# EasyEDA Pro project ProPrj_信号失真度测量_2025-12-22.epro

# Schematic Schematic3
Board Name: Board3; Create Date: 2025-10-08; Page Name: P1; Project Name: 信号失真度测量; Schematic Name: Schematic3; Update Date: 2025-10-08; Company: 嘉立创EDA; Page Size: A4; Version: V1.0
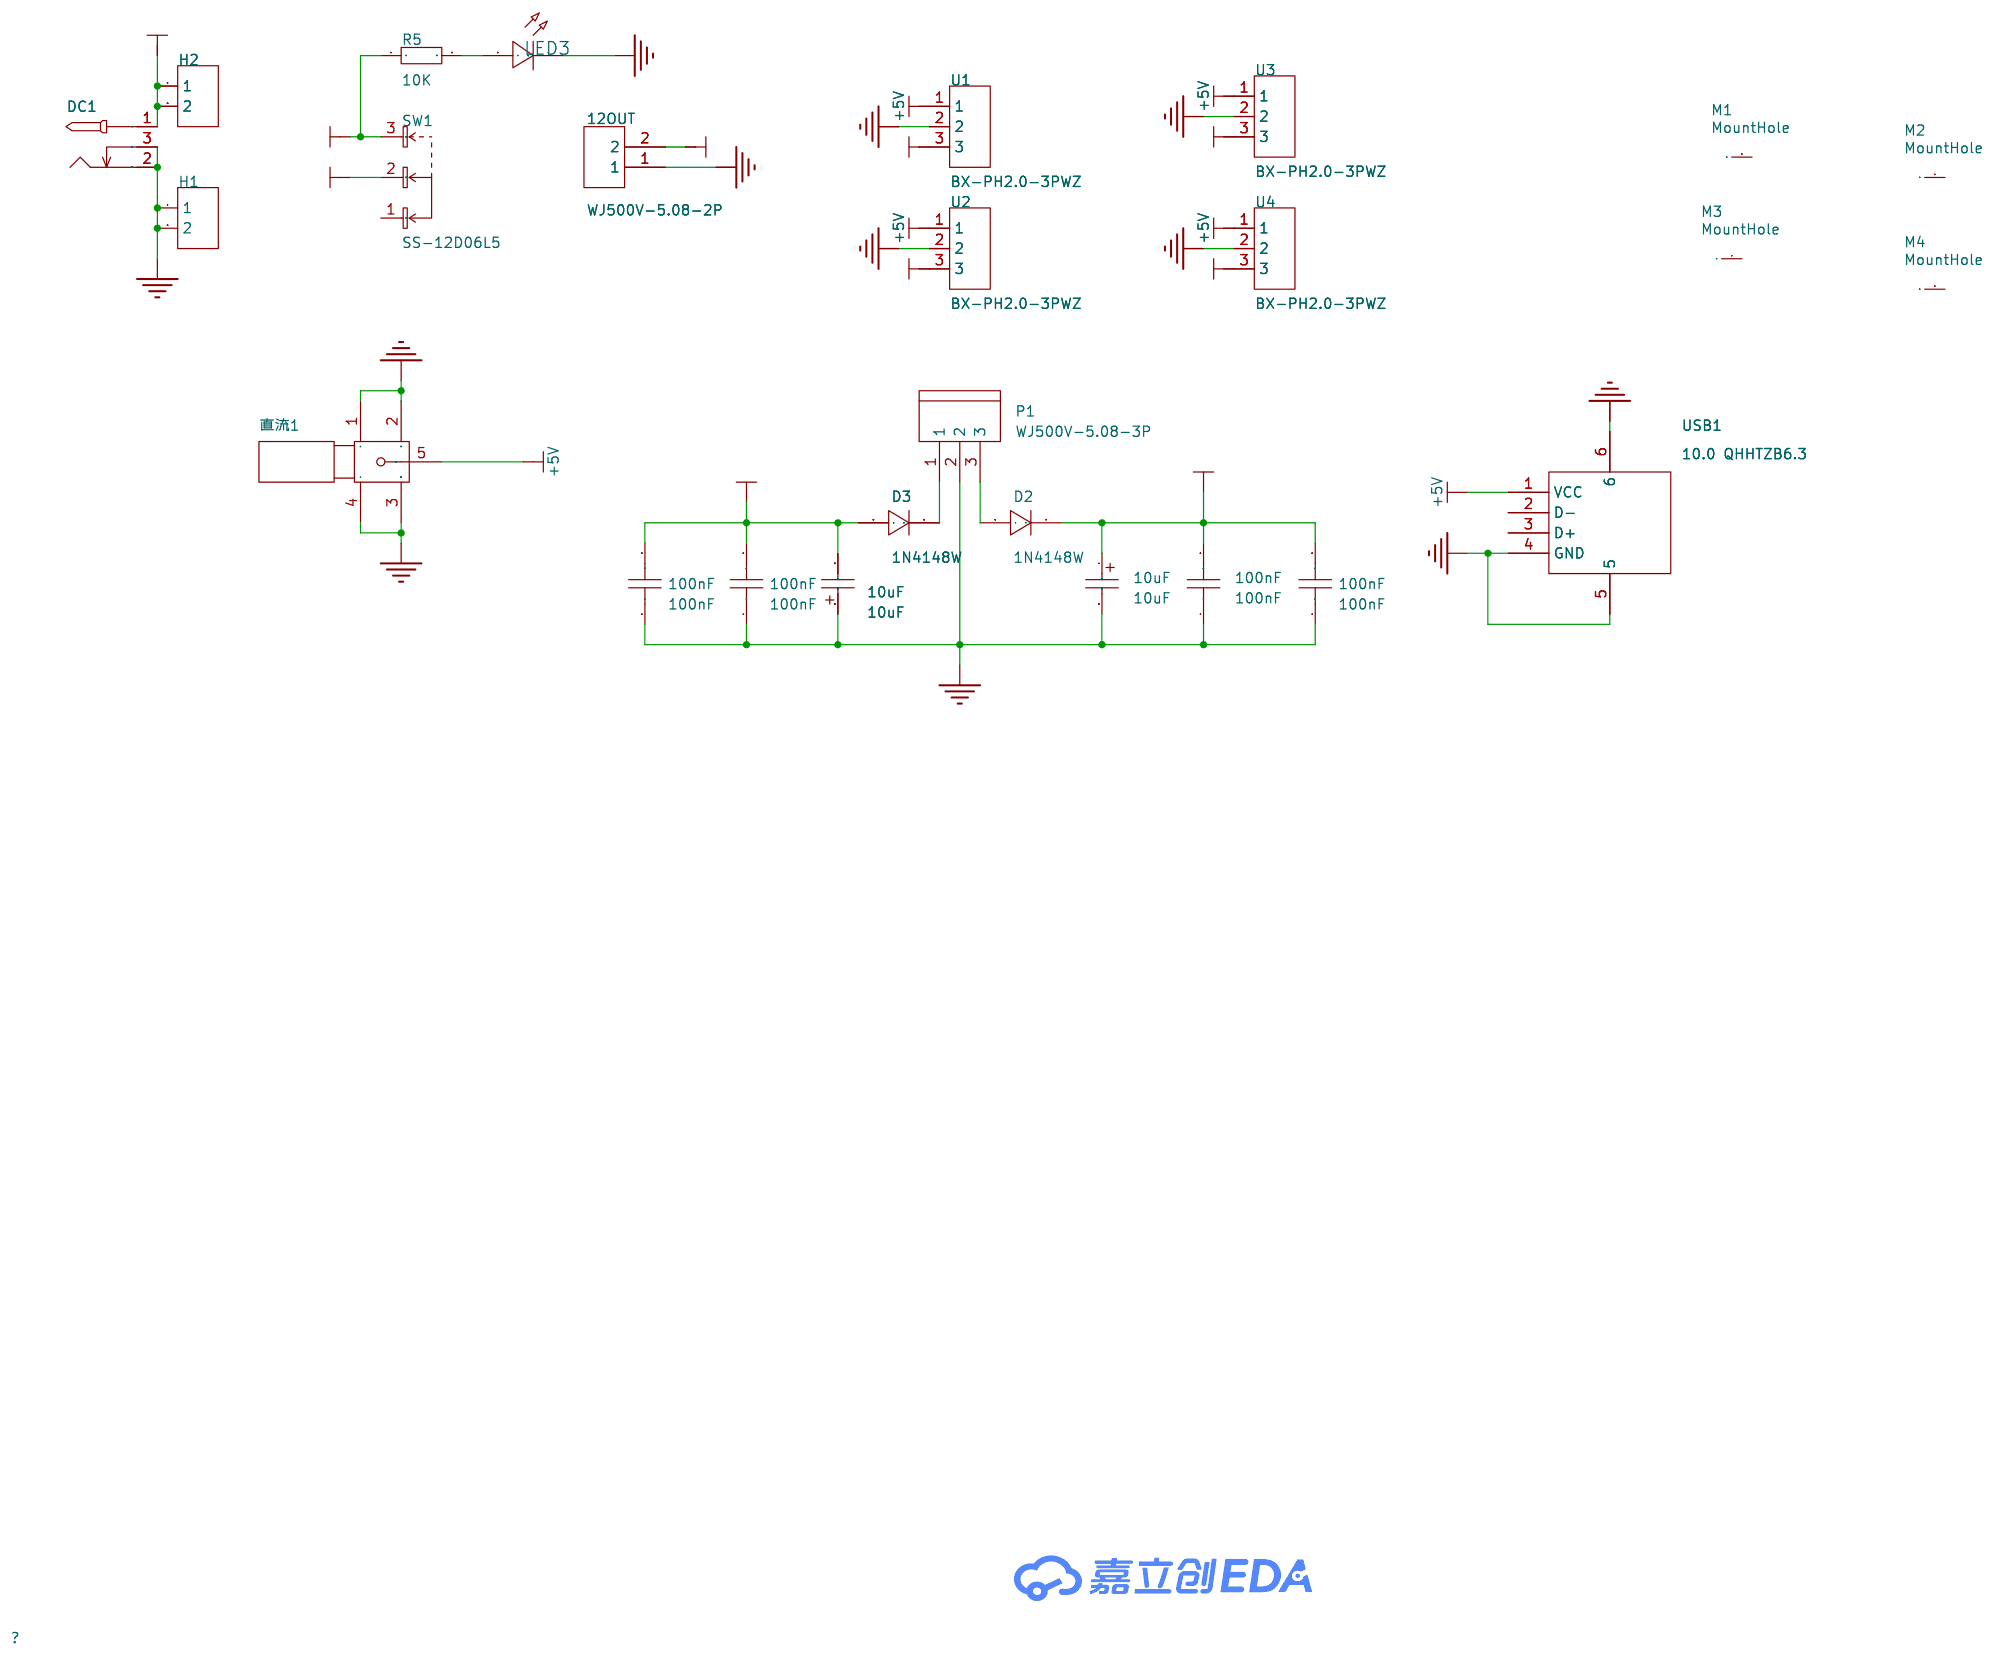
[diagram p0: schematic sheet]

## Parts
10uF  10uF  [C_Ele_SMD_5x5.4mm]
10uF#2  10uF  [C_Ele_SMD_5x5.4mm]
12OUT  WJ500V-5.08-2P  [CONN-TH_2P-P5.00_WJ500V-5.08-2P]
100nF  100nF  [C0805]
100nF#2  100nF  [C0805]
100nF#3  100nF  [C0805]
100nF#4  100nF  [C0805]
D2  1N4148W  [SOD-123F_L2.7-W1.6-LS3.8-RD]
D3  1N4148W  [SOD-123F_L2.7-W1.6-LS3.8-RD]
DC1  -  [DC-005_2.5]
H1  -  [HDR-TH_2P-P2.54-V-F]
H2  -  [HDR-TH_2P-P2.54-V-F]
LED3  -  [LED_0805]
M1  MountHole  [M3-MOUNTHOLE-PLATED]  (no BOM)
M2  MountHole  [M3-MOUNTHOLE-PLATED]  (no BOM)
M3  MountHole  [M3-MOUNTHOLE-PLATED]  (no BOM)
M4  MountHole  [M3-MOUNTHOLE-PLATED]  (no BOM)
P1  WJ500V-5.08-3P  [CONN-TH_3P-P5.00_WJ500V-5.08-3P]
R5  10K  [R0805]
SW1  SS-12D06L5  [SW-TH_3P-P4.70_L11.1-W12.7]
U1  BX-PH2.0-3PWZ  [CONN-TH_3P-P2.00_BX-PH2.0-3PWZ]
U2  BX-PH2.0-3PWZ  [CONN-TH_3P-P2.00_BX-PH2.0-3PWZ]
U3  BX-PH2.0-3PWZ  [CONN-TH_3P-P2.00_BX-PH2.0-3PWZ]
U4  BX-PH2.0-3PWZ  [CONN-TH_3P-P2.00_BX-PH2.0-3PWZ]
USB1  10.0 QHHTZB6.3  [USB-A-TH_10.0QHHTZB6.3]
直流1  -  [SMA-TH_BWSMA-KE-Z001]

## Library data of the parts
10uF 10uF#2 = C_Ele_SMD_5x5.4mm: Supplier Footprint: SMD,5x5.4mm
12OUT = WJ500V-5.08-2P: 结构:1x2P;间距:5.08mm;颜色:绿色;安装方式:直插;额定电流:18A;额定电压:250V;排数:1;线规 - AWG:14~30;线规 - 平方毫米:2.5;每排PIN数:2;触头材质:-;触头镀层:-;工作温度范围:-40℃~+105℃;焊接温度(最大值):-;; LCSC Part Name: 1x2P 5.08mm 直插 排数:1 每排P数:2; Supplier Part: C8465; Manufacturer: KANGNEX(康奈克斯电气); Supplier Footprint: 插件,P=5.08mm; JLCPCB Part Class: 扩展库; Datasheet: https://atta.szlcsc.com/upload/public/pdf/source/20191225/C8465_02D34CE5B5B4A53DF5891601D97FA9F4.pdf; Supplier: LCSC; Structure: 1x2P; Pitch: 5.08mm; Color: 绿色; Mounting Style: 直插; Current Rating (Max): 18A; Voltage Rating (Max): 250V; Number of Pins: 2P; Number of Rows: 1; Wire Gauge - AWG: 14~30; Wire Gauge - mm2: 2.5; Number of PINs Per Row: 2; Operating Temperature Range: -40℃~+105℃; Screw Specification: M2.5
100nF 100nF#2-100nF#4 = CAP_0805: Supplier Footprint: 0805
D2 D3 = 1N4148W_C81598: 二极管配置:独立式;正向压降(Vf):1V@50mA;直流反向耐压(Vr):75V;整流电流:150mA;反向恢复时间(Trr):4ns;; Supplier Part: C81598; Manufacturer: ST(先科); Supplier Footprint: SOD-123; JLCPCB Part Class: 基础库; Datasheet: https://item.szlcsc.com/datasheet/1N4148W/82750.html; Supplier: LCSC; Diode Configuration: 独立式; Voltage - Forward(Vf@If): 1V@50mA; Voltage - DC Reverse(Vr): 75V; Current - Rectified: 150mA; Pd - Power Dissipation: 400mW; Reverse Leakage Current (Ir): 1uA@75V; Reverse Recovery Time (trr): 4ns; Non-Repetitive Peak Forward Surge Current: 1A
DC1 = DC-005_2.5: Supplier Footprint: 插件
H1 H2 = HDR-F_2.54_1x2P: Supplier Part: C49661; Supplier Footprint: 插件; Supplier: LCSC; Manufacturer: BOOMELE(博穆精密); Manufacturer Part: 2.54-1*2P母; JLCPCB Part Class: Extended Part
LED3 = LED_0805-R: Supplier Footprint: 0805
M1-M4 = MountHole
P1 = WJ500V-5.08-3P: 结构:1x3P;间距:5.08mm;颜色:绿色;安装方式:直插;额定电流:18A;额定电压:250V;排数:1;线规 - AWG:14~30;线规 - 平方毫米:2.5;每排PIN数:3;工作温度范围:-40℃~+105℃;; LCSC Part Name: 5.08mm 1x3P 排数:1 每排P数:3 直插; Supplier Part: C72334; Manufacturer: KANGNEX(康奈克斯电气); Supplier Footprint: 插件,P=5.08mm; JLCPCB Part Class: 扩展库; Datasheet: https://atta.szlcsc.com/upload/public/pdf/source/20191225/C72334_8A5EF831D67650233B6B1E3F2BC06274.pdf; Supplier: LCSC; Structure: 1x3P; Pitch: 5.08mm; Color: 绿色; Mounting Style: 直插; Current Rating (Max): 18A; Voltage Rating (Max): 250V; Number of Pins: 3P; Number of Rows: 1; Wire Gauge - AWG: 14~30; Wire Gauge - mm2: 2.5; Number of PINs Per Row: 3; Operating Temperature Range: -40℃~+105℃
R5 = Res_0805: Supplier Footprint: 0805
SW1 = SS-12D06L5: 电路结构:单刀双掷;安装方式:侧插;开关颜色:黑色;额定电流(DC):3A;额定电压(DC):250V;额定电流(AC):3A;额定电压(AC):250V;机械寿命:1万次;; LCSC Part Name: 柄长5mm 卧插双档 滑动开关; Supplier Part: C319015; Manufacturer: XKB Connectivity(中国星坤); Supplier Footprint: 插件; JLCPCB Part Class: 扩展库; Datasheet: https://atta.szlcsc.com/upload/public/pdf/source/20211009/0D67854FD60FB1F6FE75130AD47C052C.pdf; Supplier: LCSC; Circuit: 单刀双掷; Actuator Style: 矩形柱状; Pin Style: PC引脚; Switch Length: 12.95mm; Switch Width: 6.6mm; Switch Height: 6.3mm; Mounting Style: 侧插; Actuator Color: 黑色; Current Rating (DC): 3A; Voltage Rating (DC): 250V; Current Rating (AC): 3A; Voltage Rating (AC): 250V; Mechanical Life: 1万次; Operating Temperature: -40℃~+85℃
U1-U4 = BX-PH2.0-3PWZ_C9900091690: Supplier Part: C9900091690; Supplier Footprint: PH2.0D-W-3P; JLCPCB Part Class: 扩展库; Supplier: LCSC
USB1 = 10.0 QHHTZB6.3: 连接器类型:Type-A;协议标准:USB 2.0;公母:母;安装方式:卧贴;触点数量:4P;端口数量:1;额定电流 - 电源:1.5A;工作温度:-25℃~+85℃;; LCSC Part Name: Type-A 母 卧贴; Supplier Part: C668591; Manufacturer: SHOU HAN(首韩); Supplier Footprint: SMD; JLCPCB Part Class: 扩展库; Datasheet: https://item.szlcsc.com/datasheet/10.0%2520QHHTZB6.3/698534.html; Supplier: LCSC; Connector Type: Type-A; Protocol Standard: USB 2.0; Gender: 母; Mounting Type: 卧贴; Number of Contacts: 4P; Number of Ports: 1; Current Rating-Power: 1.5A; Voltage Rating: 30V; Connect-Disconnect Life: 5千次; Length: 10mm; Detection color: 黑色; Operating Temperature: -25℃~+85℃
直流1 = BWSMA-KE-Z001_C496549: 连接器类型:板端;接口类型:内孔;端口数量:1;接口直径:-;接口长度/高度:-;频率:-;射频系列:SMA;阻抗:50Ω;样式:正脚;工作温度:-65℃~+165℃;; LCSC Part Name: 内孔 SMA 正脚; Supplier Part: C496549; Manufacturer: BAT WIRELESS(蝙蝠无线); Manufacturer Part: BWSMA-KE-Z001; Supplier Footprint: 插件; JLCPCB Part Class: 扩展库; Datasheet: https://item.szlcsc.com/datasheet/BWSMA-KE-Z001/508498.html; Supplier: LCSC; Connector Type: 板端; Interface: 内孔; Number of Ports: 1; RF Series: SMA; Impedance: 50Ω; Style: 正脚; Operating Temperature Range: -65℃~+165℃

## Nets
+5V: 10uF#2.1 100nF#2.2 100nF#4.2 D2.1(K) U1.1 U2.1 U3.1 U4.1 USB1.1(VCC) 直流1.5
+12V: DC1.1(4) H2.1 H2.2 SW1.2
-5V: 10uF.2 100nF.2 100nF#3.2 D3.2(A) U1.3 U2.3 U3.3 U4.3
GND: 10uF.1 10uF#2.2 12OUT.1 100nF.1 100nF#2.1 100nF#3.1 100nF#4.1 DC1.2 DC1.3 H1.1 H1.2 LED3.1(C) P1.2 U1.2 U2.2 U3.2 U4.2 USB1.4(GND) USB1.5 USB1.6 直流1.1 直流1.2 直流1.3 直流1.4
VIN: 12OUT.2 R5.1 SW1.3
$1N706: LED3.2(A) R5.2
$1N2849: D3.1(K) P1.1
$1N2856: D2.2(A) P1.3

Not connected (* = marked no-connect by the designer): M1 1; M2 1; M3 1; M4 1; SW1 1; USB1 2(D-) 3(D+)

# Schematic Schematic1
Board Name: Board1; Create Date: 2025-10-08; Page Name: P1; Project Name: 信号失真度测量; Schematic Name: Schematic1; Update Date: 2025-12-13; Company: 嘉立创EDA; Page Size: A4; Version: V1.0
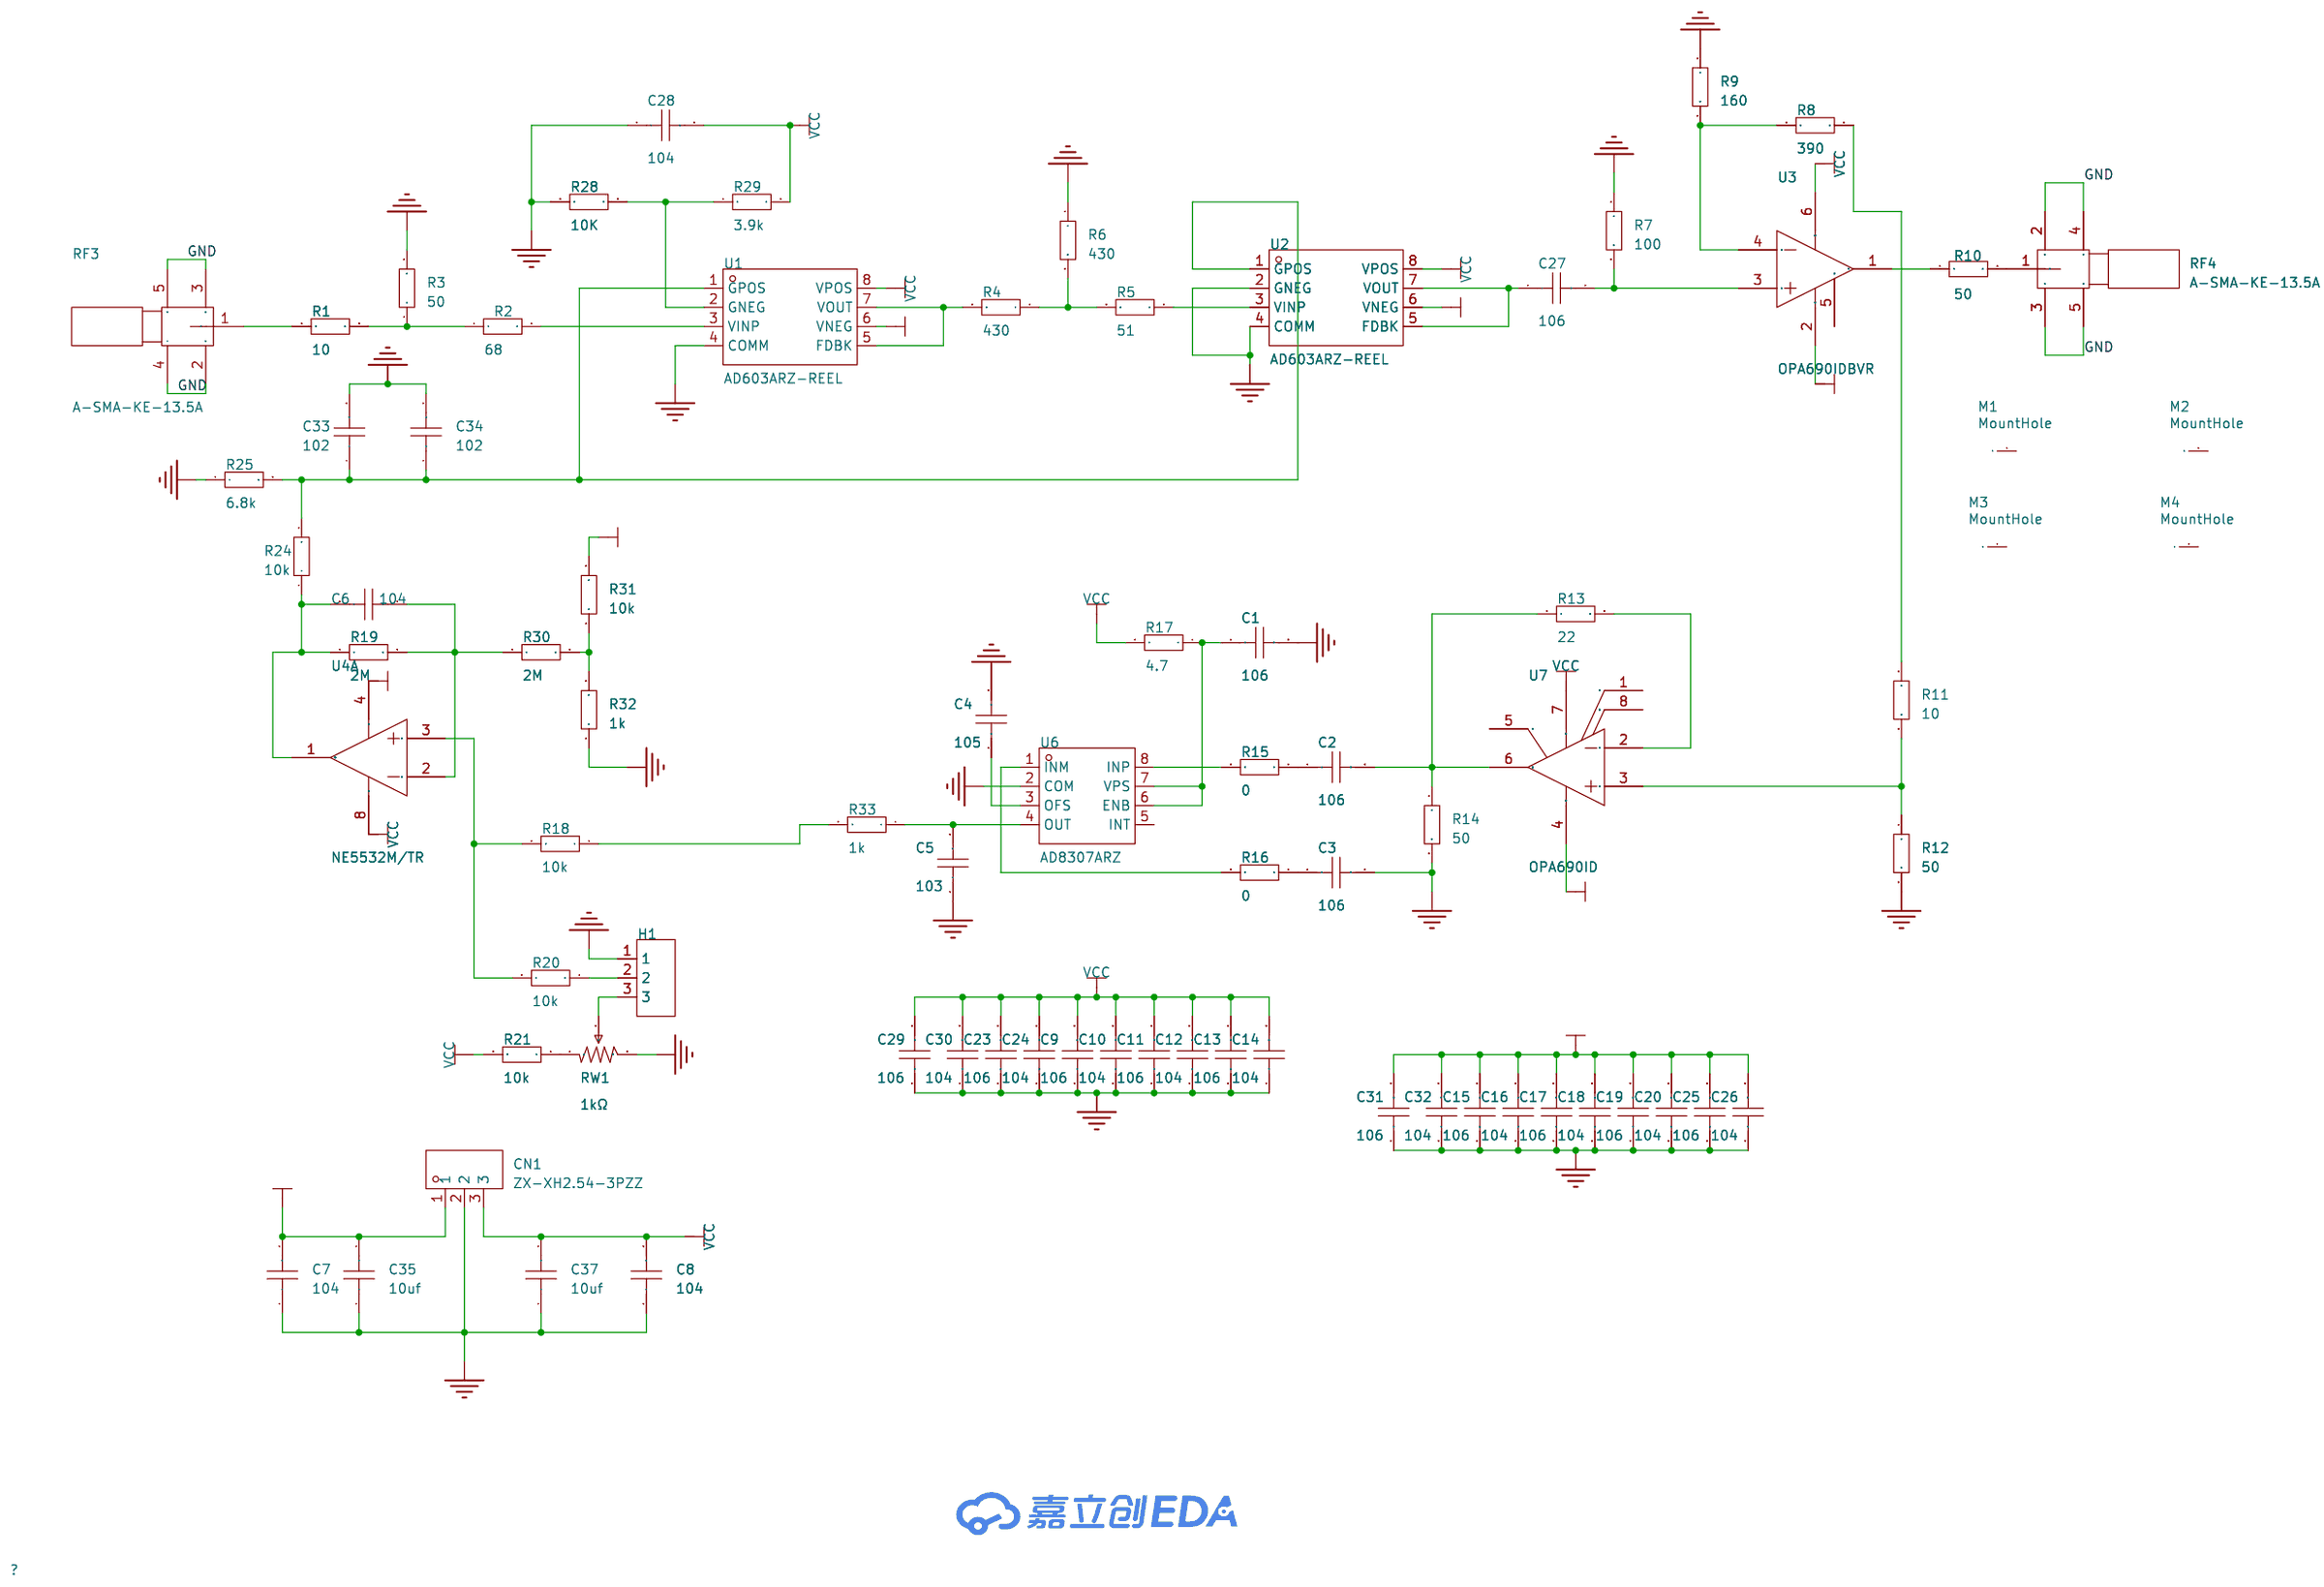
[diagram p1: schematic sheet]

## Parts
C1  106  [C0805]
C2  106  [C0805]
C3  106  [C0805]
C4  105  [C0805]
C5  103  [C0805]
C6  104  [C0805]
C7  104  [C0805]
C8  104  [C0805]
C9  106  [C0805]
C10  104  [C0805]
C11  106  [C0805]
C12  104  [C0805]
C13  106  [C0805]
C14  104  [C0805]
C15  106  [C0805]
C16  104  [C0805]
C17  106  [C0805]
C18  104  [C0805]
C19  106  [C0805]
C20  104  [C0805]
C23  106  [C0805]
C24  104  [C0805]
C25  106  [C0805]
C26  104  [C0805]
C27  106  [C0805]
C28  104  [C0805]
C29  106  [C0805]
C30  104  [C0805]
C31  106  [C0805]
C32  104  [C0805]
C33  102  [C0805]
C34  102  [C0805]
C35  10uf  [C0805]
C37  10uf  [C0805]
CN1  ZX-XH2.54-3PZZ  [CONN-TH_3P-P2.54_2501S-3P]
H1  -  [HDR-TH_3P-P2.54-V-F]
M1  MountHole  [M3-MOUNTHOLE-PLATED]  (no BOM)
M2  MountHole  [M3-MOUNTHOLE-PLATED]  (no BOM)
M3  MountHole  [M3-MOUNTHOLE-PLATED]  (no BOM)
M4  MountHole  [M3-MOUNTHOLE-PLATED]  (no BOM)
R1  10  [R0805]
R2  68  [R0805]
R3  50  [R0805]
R4  430  [R0805]
R5  51  [R0805]
R6  430  [R0805]
R7  100  [R0805]
R8  390  [R0805]
R9  160  [R0805]
R10  50  [R0805]
R11  10  [R0805]
R12  50  [R0805]
R13  22  [R0805]
R14  50  [R0805]
R15  0  [R0805]
R16  0  [R0805]
R17  4.7  [R0805]
R18  10k  [R0805]
R19  2M  [R0805]
R20  10k  [R0805]
R21  10k  [R0805]
R24  10k  [R0805]
R25  6.8k  [R0805]
R28  10K  [R0805]
R29  3.9k  [R0805]
R30  2M  [R0805]
R31  10k  [R0805]
R32  1k  [R0805]
R33  1k  [R0805]
RF3  A-SMA-KE-13.5A  [SMA-SMD_A-SMA-KE-13.5A]
RF4  A-SMA-KE-13.5A  [SMA-SMD_A-SMA-KE-13.5A]
RW1  1kΩ  [RES-ADJ-TH_3P-L9.5-W4.9-P2.50-L_3296W]
U1  AD603ARZ-REEL  [SOIC-8_L4.9-W3.9-P1.27-LS6.0-BL]
U2  AD603ARZ-REEL  [SOIC-8_L4.9-W3.9-P1.27-LS6.0-BL]
U3  OPA690IDBVR  [SOT-23-6_L2.9-W1.6-P0.95-LS2.8-BL]
U4  NE5532M/TR  [SOP-8_L4.9-W3.9-P1.27-LS6.0-BL]  (section 1)
U6  AD8307ARZ  [SOIC-8_L4.9-W3.9-P1.27-LS6.0-BL]
U7  OPA690ID  [SOIC-8_L4.9-W3.9-P1.27-LS6.0-BL]

## Library data of the parts
C1-C20 C23-C35 C37 = CAP_0805: Supplier Footprint: 0805
CN1 = ZX-XH2.54-3PZZ: 插针结构:1x3P;间距:2.5mm;安装方式:直插;参考系列:XH;总PIN数:3P;排数:1;每排PIN数:3;行距:-;额定电流:3A;触头材质:黄铜;触头镀层:锡;工作温度:-25℃~+85℃;; LCSC Part Name: 1x3P 间距:2.5mm 直插 系列:XH; Supplier Part: C7429633; Manufacturer: Megastar(兆星); Supplier Footprint: 插件,P=2.5mm; JLCPCB Part Class: 扩展库; Datasheet: https://item.szlcsc.com/datasheet/ZX-XH2.54-3PZZ/8427550.html; Supplier: LCSC; Pins Structure: 1x3P; Pitch: 2.5mm; Mounting Type: 直插; Reference Series: XH; Number of Pins: 3P; Number of Rows: 1; Number of PINs Per Row: 3; Current Rating: 3A; Contact Material: 黄铜; Contact Plating: 锡; Operating Temperature: -25℃~+85℃; Voltage Rating: 250V; Plastic Material: PA66; Flame Retardant Rating: UL94V-0; Color: 白色; Z-Height of the Board: 7mm; X-Length of Bottom Edge on Board (Spacing Line): 10mm; Y-Width of Bottom Edge on Board: 5.9mm
H1 = HDR-F_2.54_1x3P: Supplier Part: C541850; Supplier Footprint: 插件
M1-M4 = MountHole
R1-R21 R24 R25 R28-R33 = Res_0805: Supplier Footprint: 0805
RF3 RF4 = A-SMA-KE-13.5A: 样式：偏脚 接口长度：6.5mm 射频SMA-KE/KWE/KHD/IPEX/IPX接头 天线插座 内孔弯头偏脚立式      镀金 SMA—KE直头外螺纹内孔半螺牙；铜镀金 1：高等级黄铜材质镀真金，镀金2u/1u； 2：纯铜无杂质高品质可过环保认证； 3：经过高精密盐雾48H； 4：防止氧化，抗氧化性比较好，耐腐蚀，可减少损耗。; LCSC Part Name: 内孔 SMA SMA母头PCB天线座/安装直头/SMA端口 RF射频天线直头端子 13.5mm; Supplier Part: C22467594; Manufacturer: MyAntenna(摩天射频); Supplier Footprint: SMD; JLCPCB Part Class: 扩展库; Datasheet: https://item.szlcsc.com/datasheet/A-SMA-KE-13.5A/24170451.html; Supplier: LCSC
RW1 = 3296W-1-204LF_C49190460: 阻值:200kΩ;精度:±10%;功率:500mW;温度系数:±150ppm/℃;; LCSC Part Name: 3296W-1-204LF; Supplier Part: C49190460; Manufacturer: JIERR(捷而瑞); Manufacturer Part: 3296W-1-204LF; Supplier Footprint: 插件-3P,9.5x4.9mm; JLCPCB Part Class: 扩展库; Datasheet: https://item.szlcsc.com/datasheet/3296W-1-204LF/51587053.html; Supplier: LCSC; Tolerance: ±10%; Power(Watts): 500mW; Temperature Coefficient: ±150ppm/℃; Number of Turns: 28
U1 U2 = AD603ARZ-REEL: 低噪声、90MHz可变增益放大器; LCSC Part Name: 低噪声90MHz可变增益放大器; Supplier Part: C578331; Manufacturer: ADI(亚德诺); Supplier Footprint: SOIC-8; JLCPCB Part Class: 扩展库; Datasheet: https://atta.szlcsc.com/upload/public/pdf/source/20200225/C428870_2540098E542F69B8418644EFC7A80A81.pdf; Supplier: LCSC
U3 = OPA690IDBVR: 放大器数:单路;轨到轨:-;增益带宽积(GBP):250MHz;输入失调电压(Vos):4.7mV;压摆率(SR):1.8V/ns;输入偏置电流(Ib):12uA;; Supplier Part: C524799; Manufacturer: TI(德州仪器); Supplier Footprint: SOT-23-6; JLCPCB Part Class: 扩展库; Datasheet: https://www.ti.com/cn/lit/gpn/opa690; Supplier: LCSC; Number of Channels: 单路; Maximum Power Supply Range (Vdd-Vss): 12V; Gain Bandwidth Product: 250MHz; Vos - Input Offset Voltage: 4.7mV; Input Offset Voltage Drift(Vos TC): 10uV/℃; Slew Rate: 1.8V/ns; Ib - Input Bias Current: 12uA; Input Offset Current(Ios): 1uA; Noise density(eN): 5.5nV/√Hz; Common Mode Rejection Ratio(CMRR): 65dB; Input offset current drift(Ios TC): 7nA/℃; Quiescent Current: 5.5mA; Output Current: 190mA; Operating Temperature: -40℃~+85℃; Single supply: 5V~12V; Dual Supply: 2.5V~5V；-5V~-2.5V
U4 = NE5532M/TR: 放大器数:双路;轨到轨:-;增益带宽积(GBP):-;输入失调电压(Vos):5mV;压摆率(SR):11V/us;输入偏置电流(Ib):500nA;; LCSC Part Name: 双运算放大器; Supplier Part: C434481; Manufacturer: HGSEMI(华冠); Supplier Footprint: SOP-8; JLCPCB Part Class: 扩展库; Datasheet: https://item.szlcsc.com/datasheet/NE5532M%252FTR/431624.html; Supplier: LCSC; Number of Channels: 双路; Maximum Power Supply Range (Vdd-Vss): 44V; Vos - Input Offset Voltage: 5mV; Slew Rate: 11V/us; Ib - Input Bias Current: 500nA; Noise density(eN): 8nV/√Hz@1kHz; Common Mode Rejection Ratio(CMRR): 100dB; Operating Temperature: 0℃~+70℃; Dual Supply: -22V~22V
U6 = AD8307ARZ: 放大器数:-;; Supplier Part: C578685; Manufacturer: ADI(亚德诺); Supplier Footprint: SOIC-8; JLCPCB Part Class: 扩展库; Datasheet: https://atta.szlcsc.com/upload/public/pdf/source/20200312/C495272_F0CE1A32DF3675295390A0A9AB819728.pdf; Supplier: LCSC
U7 = OPA690ID: 放大器数:单路;轨到轨:-;增益带宽积(GBP):250MHz;输入失调电压(Vos):1mV;压摆率(SR):1.8V/ns;输入偏置电流(Ib):3uA;; LCSC Part Name: 带关断功能的宽带电压反馈运算放大器; Supplier Part: C1346889; Manufacturer: TI(德州仪器); Supplier Footprint: SOIC-8; JLCPCB Part Class: 扩展库; Datasheet: https://www.ti.com/cn/lit/gpn/opa690; Supplier: LCSC; Number of Channels: 单路; Maximum Power Supply Range (Vdd-Vss): 12V; Gain Bandwidth Product: 250MHz; Vos - Input Offset Voltage: 1mV; Input Offset Voltage Drift(Vos TC): 10uV/℃; Slew Rate: 1.8V/ns; Ib - Input Bias Current: 3uA; Input Offset Current(Ios): 1uA; Noise density(eN): 5.5nV/√Hz@1MHz; Common Mode Rejection Ratio(CMRR): 65dB; Input offset current drift(Ios TC): 7nA/℃; Quiescent Current: 5.5mA; Output Current: 190mA; Operating Temperature: -40℃~+85℃; Single supply: 5V~12V; Dual Supply: -6V~-2.5V；2.5V~6V

## Nets
GND: C1.2 C3.2 C4.2 C5.1 C7.1 C8.1 C9.1 C10.1 C11.1 C12.1 C13.1 C14.1 C15.1 C16.1 C17.1 C18.1 C19.1 C20.1 C23.1 C24.1 C25.1 C26.1 C28.1 C29.1 C30.1 C31.1 C32.1 C33.2 C34.2 C35.1 C37.1 CN1.2 H1.1 R3.2 R6.1 R7.1 R9.1 R12.2 R14.2 R25.1 R28.1 R32.1 RF3.2 RF3.3 RF3.4 RF3.5 RF4.2 RF4.3 RF4.4 RF4.5 RW1.3 U1.4(COMM) U2.2(GNEG) U2.4(COMM) U6.2(COM)
VCC: C8.2 C9.2 C10.2 C11.2 C12.2 C13.2 C14.2 C23.2 C24.2 C28.2 C29.2 C30.2 C37.2 CN1.3 R17.2 R21.2 R29.2 U1.8(VPOS) U2.8(VPOS) U3.6(VCC) U4.8(VCC+) U7.7(+VS)
VEE: C7.2 C15.2 C16.2 C17.2 C18.2 C19.2 C20.2 C25.2 C26.2 C31.2 C32.2 C35.2 CN1.1 R31.2 U1.6(VNEG) U2.6(VNEG) U3.2(VEE) U4.4(VCC-) U7.4(-VS)
$1N3249: C27.1 U2.5(FDBK) U2.7(VOUT)
$1N3303: R4.2 U1.5(FDBK) U1.7(VOUT)
$1N3353: R28.2 R29.1 U1.2(GNEG)
$1N3727: R10.1 U3.1(OUT)
$1N9984: R1.1 RF3.1
$1N9995: R1.2 R2.1 R3.1
$1N10003: R2.2 U1.3(VINP)
$1N10949: R4.1 R5.2 R6.2
$1N10954: R5.1 U2.3(VINP)
$1N11121: C27.2 R7.2 U3.3(IN+)
$1N11380: R8.1 R9.2 U3.4(IN-)
$1N11448: C33.1 C34.1 R24.2 R25.2 U1.1(GPOS) U2.1(GPOS)
$1N11598: C6.2 R19.1 R24.1 U4.1(OUT1)
$1N11604: C6.1 R19.2 R30.1 U4.2(IN1-)
$1N11741: R30.2 R31.1 R32.2
$1N11936: R18.2 R20.2 U4.3(IN1+)
$1N12020: H1.2 R20.1
$1N12185: R21.1 RW1.1
$1N12671: R18.1 R33.2
$1N12821: C4.1 U6.3(OFS)
$1N12864: C5.2 R33.1 U6.4(OUT)
$1N12907: R16.2 U6.1(INM)
$1N12916: C1.1 R17.1 U6.6(ENB) U6.7(VPS)
$1N12924: R15.2 U6.8(INP)
$1N13008: C2.1 R15.1
$1N13036: C3.1 R16.1
$1N13203: C2.2 R13.1 R14.1 U7.6(OUT)
$1N13290: R13.2 U7.2(IN-)
$1N13397: R11.2 R12.1 U7.3(IN+)
$1N13402: R8.2 R11.1
$1N13429: R10.2 RF4.1
$1N14118: H1.3 RW1.2

Not connected (* = marked no-connect by the designer): M1 1; M2 1; M3 1; M4 1; U3 5(#DIS); U6 5(INT); U7 1(NC) 5(NC) 8(DIS#)

# Schematic Schematic2
Board Name: Board2; Create Date: 2025-10-08; Page Name: P1; Project Name: 信号失真度测量; Schematic Name: Schematic2; Update Date: 2025-12-06; Company: 嘉立创EDA; Page Size: A4; Version: V1.0
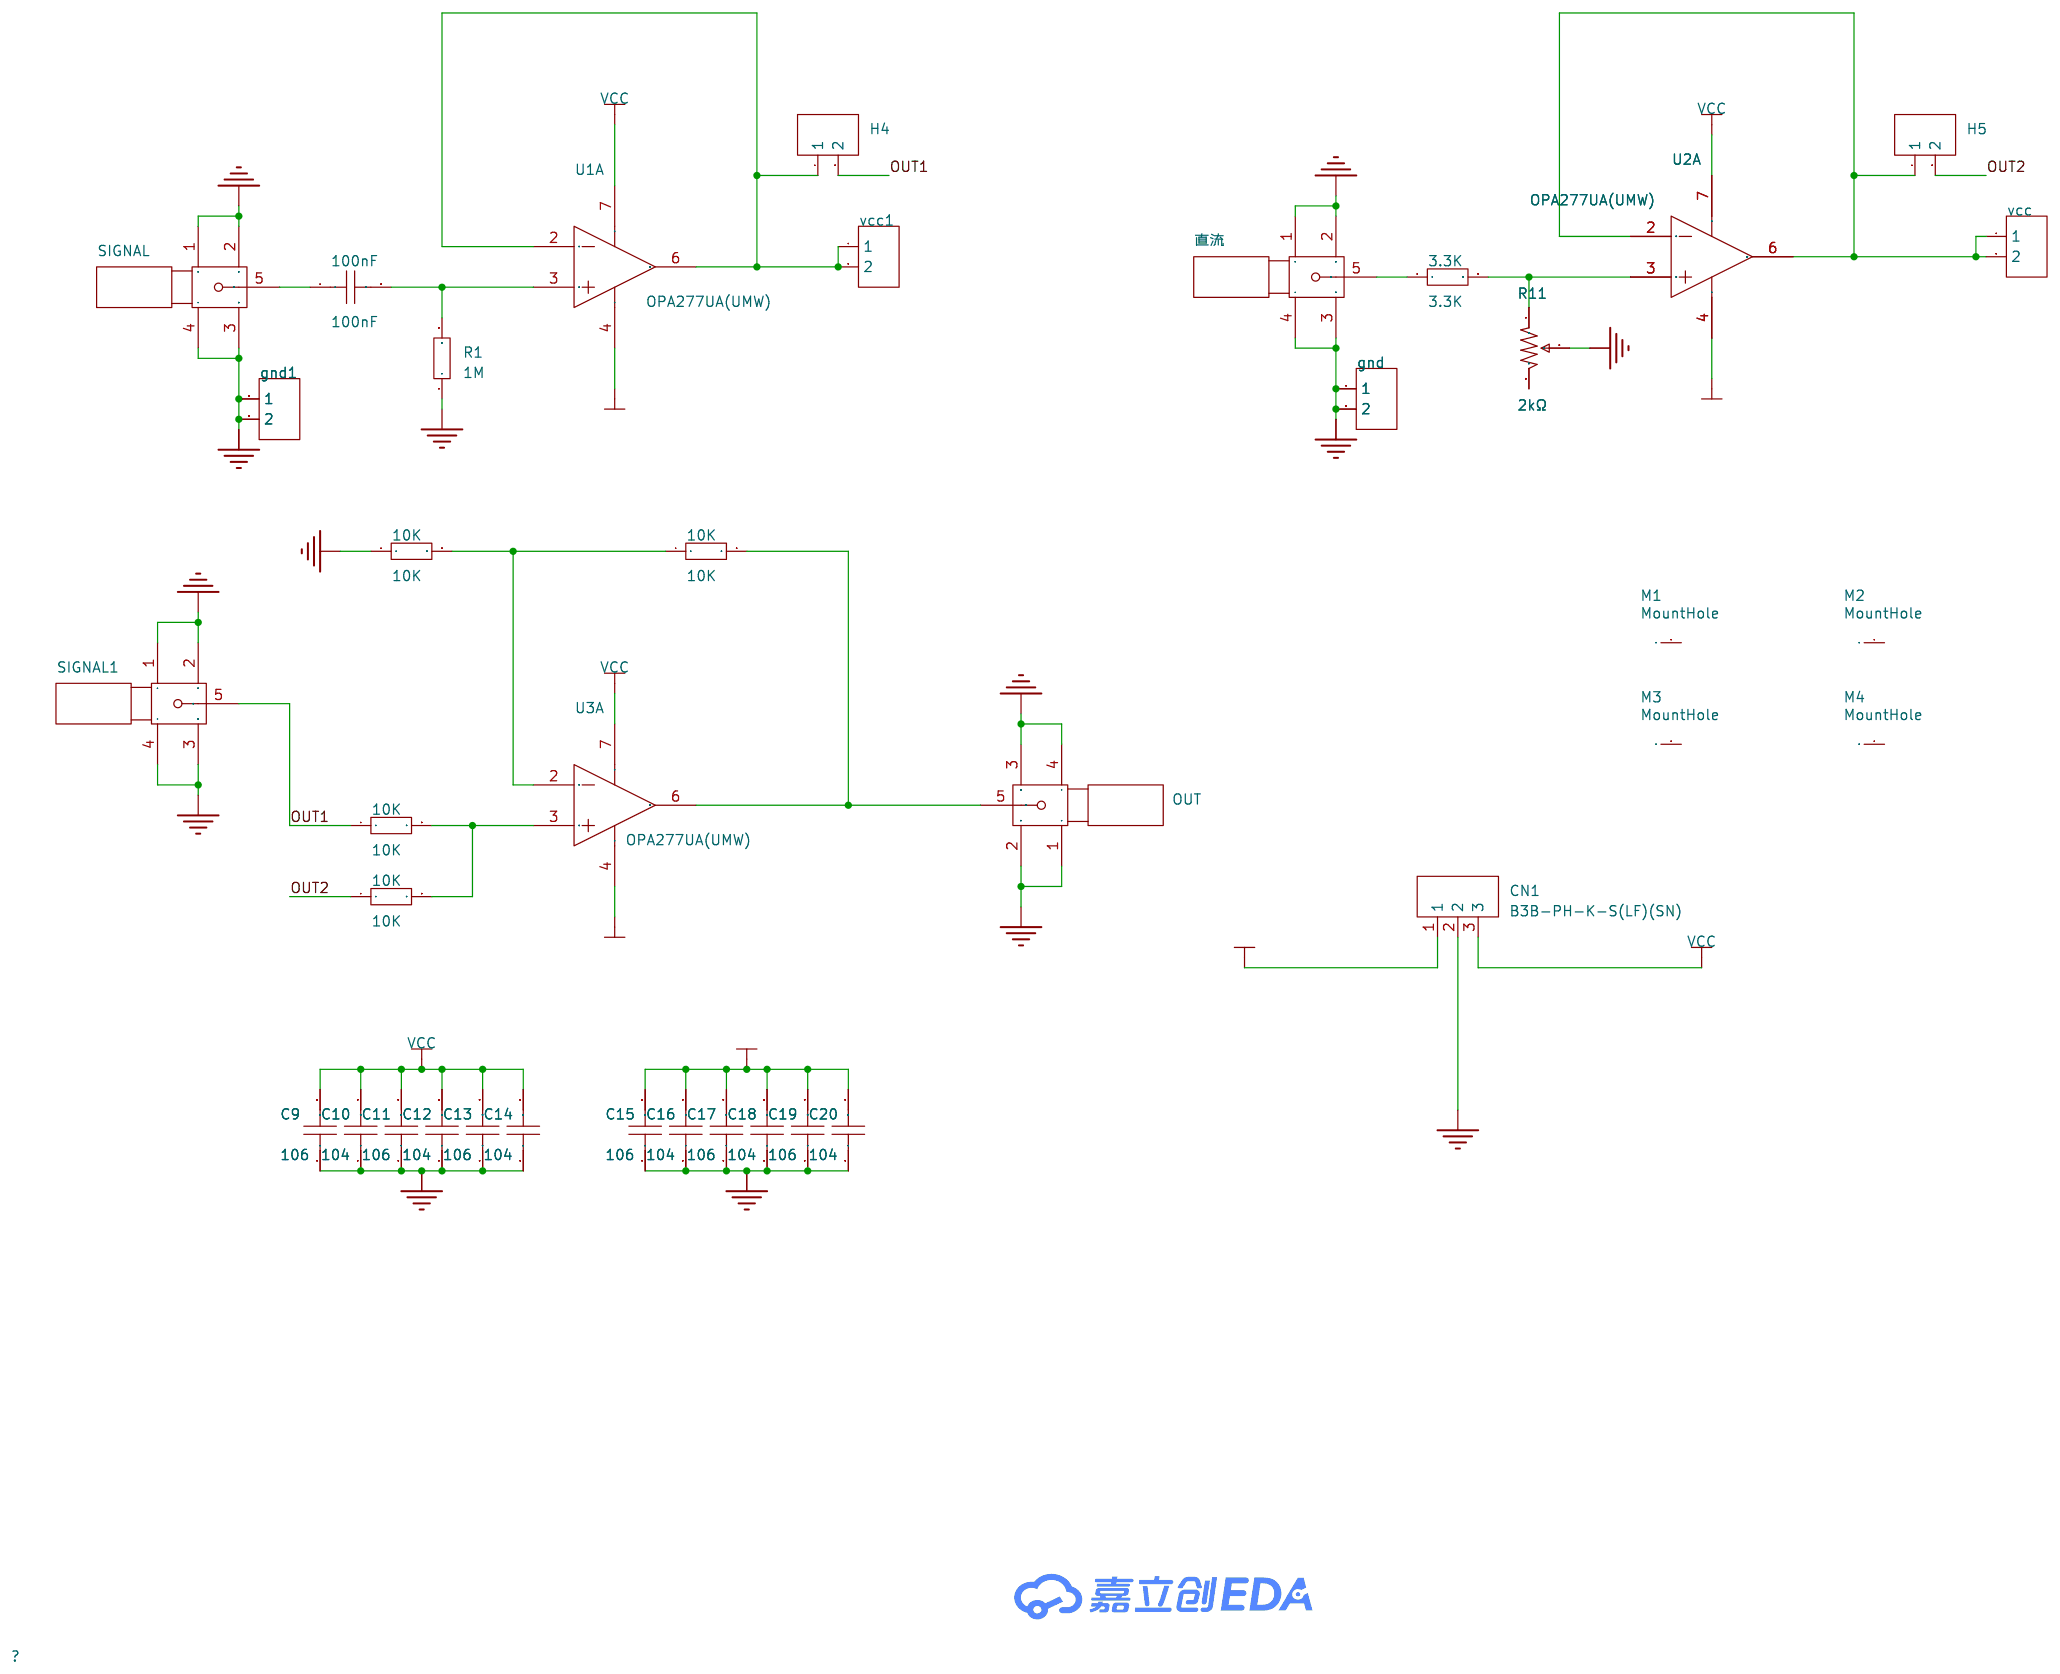
[diagram p2: schematic sheet]

## Parts
3.3K  3.3K  [R0805]
10K  10K  [R0805]
10K#2  10K  [R0805]
10K#3  10K  [R0805]
10K#4  10K  [R0805]
100nF  100nF  [C0805]
C9  106  [C0805]
C10  104  [C0805]
C11  106  [C0805]
C12  104  [C0805]
C13  106  [C0805]
C14  104  [C0805]
C15  106  [C0805]
C16  104  [C0805]
C17  106  [C0805]
C18  104  [C0805]
C19  106  [C0805]
C20  104  [C0805]
CN1  B3B-PH-K-S(LF)(SN)  [CONN-TH_B3B-PH-K-S]
gnd  -  [HDR-TH_2P-P2.54-V-F]
gnd1  -  [HDR-TH_2P-P2.54-V-F]
H4  -  [HDR-TH_2P-P2.54-V-F]
H5  -  [HDR-TH_2P-P2.54-V-F]
M1  MountHole  [M3-MOUNTHOLE-PLATED]  (no BOM)
M2  MountHole  [M3-MOUNTHOLE-PLATED]  (no BOM)
M3  MountHole  [M3-MOUNTHOLE-PLATED]  (no BOM)
M4  MountHole  [M3-MOUNTHOLE-PLATED]  (no BOM)
OUT  -  [SMA-TH_BWSMA-KE-Z001]
R1  1M  [R0805]
R11  2kΩ  [RES-ADJ-TH_3362P]
SIGNAL  -  [SMA-TH_BWSMA-KE-Z001]
SIGNAL1  -  [SMA-TH_BWSMA-KE-Z001]
U1  OPA277UA(UMW)  [SOP-8_L4.9-W3.9-P1.27-LS6.0-BL]  (section 1)
U2  OPA277UA(UMW)  [SOP-8_L4.9-W3.9-P1.27-LS6.0-BL]  (section 1)
U3  OPA277UA(UMW)  [SOP-8_L4.9-W3.9-P1.27-LS6.0-BL]  (section 1)
vcc  -  [HDR-TH_2P-P2.54-V-F]
vcc1  -  [HDR-TH_2P-P2.54-V-F]
直流  -  [SMA-TH_BWSMA-KE-Z001]

## Library data of the parts
3.3K 10K 10K#2-10K#4 R1 = Res_0805: Supplier Footprint: 0805
100nF C9-C20 = CAP_0805: Supplier Footprint: 0805
CN1 = B3B-PH-K-S(LF)(SN): 插针结构:1x3P;间距:2mm;安装方式:直插;参考系列:PH;总PIN数:3P;排数:1;每排PIN数:3;行距:-;额定电流:2A;触头材质:黄铜;触头镀层:锡;工作温度:-25℃~+85℃;; LCSC Part Name: 1x3P 间距:2mm 直插 系列:PH; Supplier Part: C131339; Manufacturer: JST; Supplier Footprint: 插件,P=2mm; JLCPCB Part Class: 扩展库; Datasheet: https://item.szlcsc.com/datasheet/B3B-PH-K-S(LF)(SN)/142632.html; Supplier: LCSC; Pins Structure: 1x3P; Pitch: 2mm; Mounting Type: 直插; Reference Series: PH; Number of Pins: 3P; Number of Rows: 1; Number of PINs Per Row: 3; Current Rating: 2A; Contact Material: 黄铜; Contact Plating: 锡; Operating Temperature: -25℃~+85℃; Voltage Rating: 100V; Plastic Material: PA66; Flame Retardant Rating: UL94V-0; Supplementary Features: 打K脚; Color: 白色; Z-Height of the Board: 6mm; X-Length of Bottom Edge on Board (Spacing Line): 7.9mm; Y-Width of Bottom Edge on Board: 4.5mm
gnd gnd1 H4 H5 vcc vcc1 = HDR-F_2.54_1x2P: Supplier Part: C49661; Supplier Footprint: 插件
M1-M4 = MountHole
OUT SIGNAL SIGNAL1 直流 = BWSMA-KE-Z001_C496549: 连接器类型:板端;接口类型:内孔;端口数量:1;接口直径:-;接口长度/高度:-;频率:-;射频系列:SMA;阻抗:50Ω;样式:正脚;工作温度:-65℃~+165℃;; LCSC Part Name: 内孔 SMA 正脚; Supplier Part: C496549; Manufacturer: BAT WIRELESS(蝙蝠无线); Manufacturer Part: BWSMA-KE-Z001; Supplier Footprint: 插件; JLCPCB Part Class: 扩展库; Datasheet: https://item.szlcsc.com/datasheet/BWSMA-KE-Z001/508498.html; Supplier: LCSC; Connector Type: 板端; Interface: 内孔; Number of Ports: 1; RF Series: SMA; Impedance: 50Ω; Style: 正脚; Operating Temperature Range: -65℃~+165℃
R11 = 3362P-1-103_C48997914: 阻值:10kΩ;精度:±10%;功率:500mW;温度系数:±250ppm/℃;; LCSC Part Name: 3362P-1-103; Supplier Part: C48997914; Manufacturer: JIERR(捷而瑞); Manufacturer Part: 3362P-1-103; Supplier Footprint: 插件-3P,7x6.8mm; JLCPCB Part Class: 扩展库; Datasheet: https://item.szlcsc.com/datasheet/3362P-1-103/51342050.html; Supplier: LCSC; Tolerance: ±10%; Power(Watts): 500mW; Temperature Coefficient: ±250ppm/℃; Number of Turns: 1
U1-U3 = OPA277UA(UMW): LCSC Part Name: 高精度运算放大器; Supplier Part: C22365312; Manufacturer: UMW(友台半导体); Supplier Footprint: SOP-8; JLCPCB Part Class: 扩展库; Datasheet: https://atta.szlcsc.com/upload/public/pdf/source/20240321/6D023FFE57E2427F76F52C4463581081.pdf; Supplier: LCSC

## Nets
GND: 10K#3.1 C9.1 C10.1 C11.1 C12.1 C13.1 C14.1 C15.1 C16.1 C17.1 C18.1 C19.1 C20.1 CN1.2 gnd.1 gnd.2 gnd1.1 gnd1.2 OUT.1 OUT.2 OUT.3 OUT.4 R1.1 R11.2 SIGNAL.1 SIGNAL.2 SIGNAL.3 SIGNAL.4 SIGNAL1.1 SIGNAL1.2 SIGNAL1.3 SIGNAL1.4 直流.1 直流.2 直流.3 直流.4
VCC: C9.2 C10.2 C11.2 C12.2 C13.2 C14.2 CN1.3 U1.7(V+) U2.7(V+) U3.7(V+)
VEE: C15.2 C16.2 C17.2 C18.2 C19.2 C20.2 CN1.1 U1.4(V-) U2.4(V-) U3.4(V-)
OUT1: 10K#2.1 H4.2 SIGNAL1.5
OUT2: 10K.1 H5.2
$1N724: 100nF.2 R1.2 U1.3(IN+)
$1N819: 100nF.1 SIGNAL.5
$1N1086: H4.1 U1.2(IN-) U1.6(OUT) vcc1.1 vcc1.2
$1N1560: 3.3K.2 R11.1 U2.3(IN+)
$1N1566: 3.3K.1 直流.5
$1N1600: H5.1 U2.2(IN-) U2.6(OUT) vcc.1 vcc.2
Net-(10K#3-2): 10K#3.2 10K#4.1 U3.2(IN-)
Net-(10K#4-2): 10K#4.2 OUT.5 U3.6(OUT)
Net-(10K-2): 10K.2 10K#2.2 U3.3(IN+)

Not connected (* = marked no-connect by the designer): M1 1; M2 1; M3 1; M4 1; R11 3

# Board PCB3
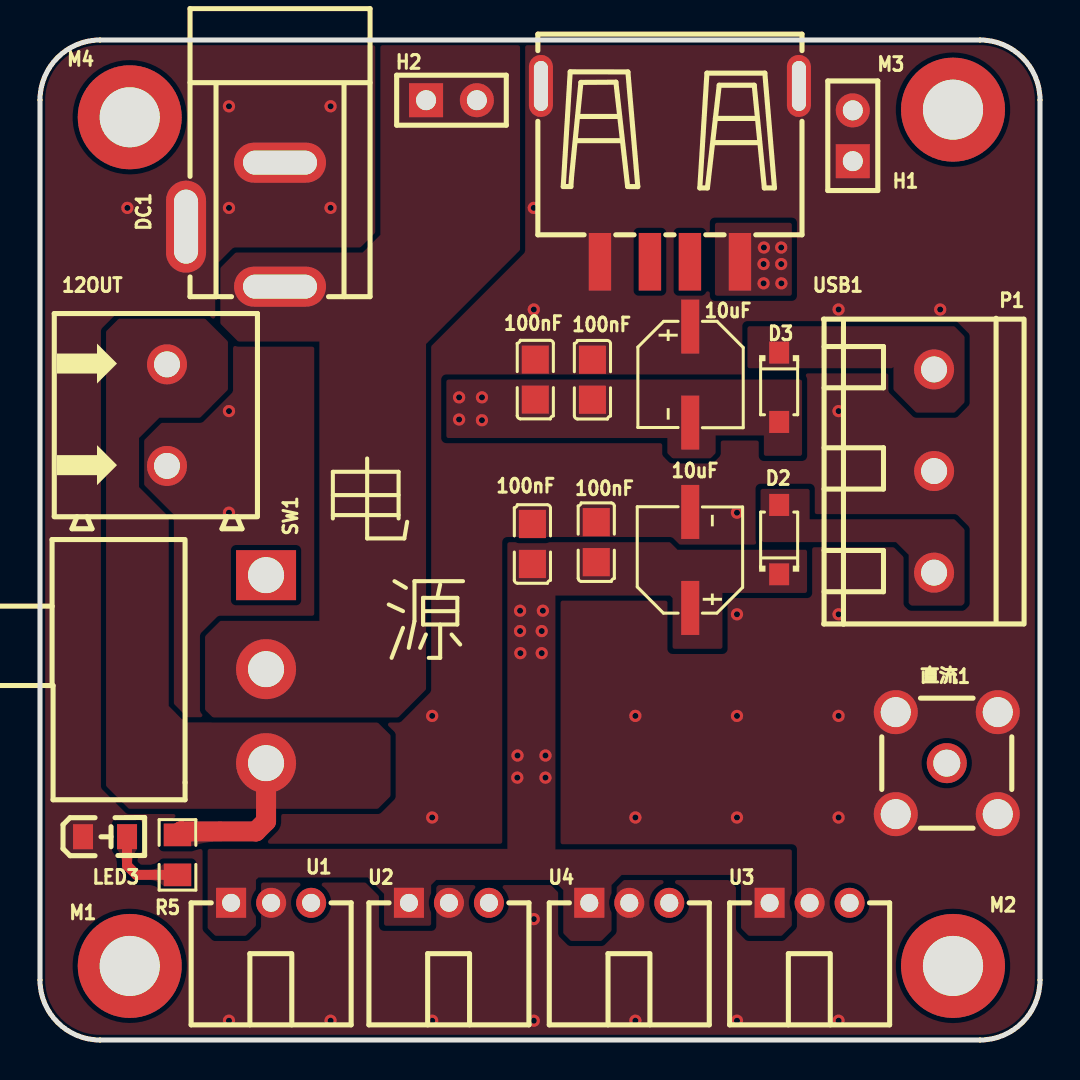
[diagram p3: board, top side]
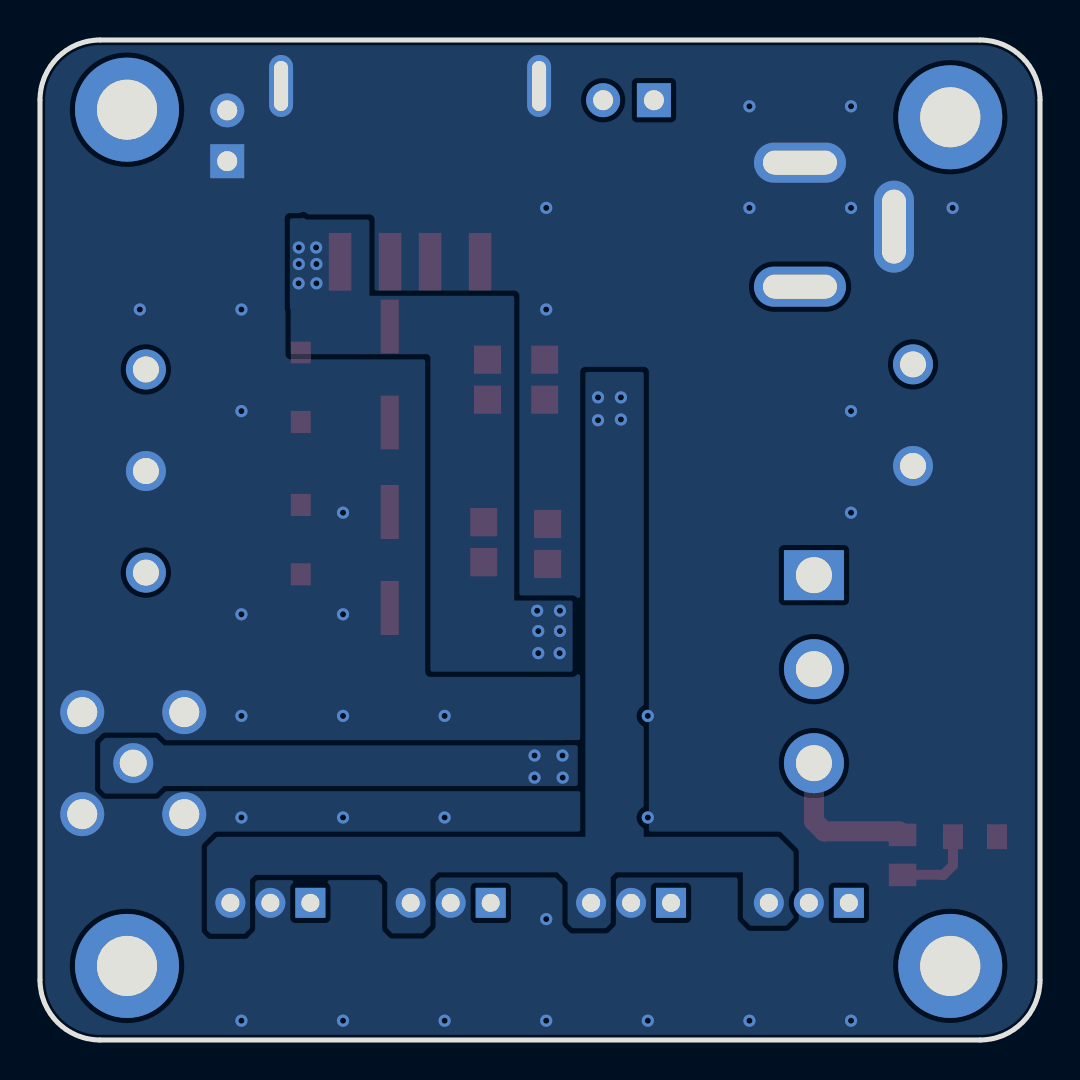
[diagram p4: board, bottom side, seen from below]

Outline 50 x 50 mm; copper layers: Top Layer, Bottom Layer. Coordinates in mm from the lower left corner of the outline.
Outline path: 0,47 0,3 arc(0.88,0.88) 3,0 47,0 arc(49.12,0.88) 50,3 50,47 arc(49.12,49.12) 47,50 3,50 arc(0.88,49.12) 0,47
Stack: Top Layer 0.035mm / Dielectric1 1.51mm FR4 er 4.5 / Bottom Layer 0.035mm

## Design rules (mm)
template: 自定义配置
spacing copperThickness1oz (default): track to track 0.102, other pairs 0.152 to 0.3
spacing copperThickness2oz: track to track 0.203, other pairs 0.152 to 0.3
track width copperThickness1oz (default): min 0.127, default 0.254, max 2.54
track width copperThickness2oz: min 0.203, default 0.254, max 2.54
differential pair differentialPair (default): width min 0.127, default 0.254, max 2.54; gap min 0.152, default 0.152
via viaSize (default): diameter min 0.5, default 0.61, max 10; hole min 0.3, default 0.305, max 6.3

## Placement (name value [footprint] x y rotation side)
10uF  10uF  [C_Ele_SMD_5x5.4mm]  32.51 33.27 270 top
10uF#2  10uF  [C_Ele_SMD_5x5.4mm]  32.51 24 90 top
12OUT  WJ500V-5.08-2P  [CONN-TH_2P-P5.00_WJ500V-5.08-2P]  6.35 31.24 90 top
100nF  100nF  [C0805]  27.62 33.01 270 top
100nF#2  100nF  [C0805]  24.62 24.8 270 top
100nF#3  100nF  [C0805]  24.76 33.02 270 top
100nF#4  100nF  [C0805]  27.81 24.89 270 top
D2  1N4148W  [SOD-123F_L2.7-W1.6-LS3.8-RD]  36.96 25.02 90 top
D3  1N4148W  [SOD-123F_L2.7-W1.6-LS3.8-RD]  36.96 32.64 270 top
DC1  -  [DC-005_2.5]  11.68 40.89 90 top
H1  -  [HDR-TH_2P-P2.54-V-F]  40.64 45.21 90 top
H2  -  [HDR-TH_2P-P2.54-V-F]  20.57 46.99 0 top
LED3  -  [LED_0805]  3.3 10.16 0 top
M1  MountHole  [M3-MOUNTHOLE-PLATED]  4.49 3.7 0 top
M2  MountHole  [M3-MOUNTHOLE-PLATED]  45.65 3.7 0 top
M3  MountHole  [M3-MOUNTHOLE-PLATED]  45.65 46.52 0 top
M4  MountHole  [M3-MOUNTHOLE-PLATED]  4.49 46.14 0 top
P1  WJ500V-5.08-3P  [CONN-TH_3P-P5.00_WJ500V-5.08-3P]  44.7 28.45 270 top
R5  10K  [R0805]  6.87 9.25 270 top
SW1  SS-12D06L5  [SW-TH_3P-P4.70_L11.1-W12.7]  11.3 18.54 270 top
U1  BX-PH2.0-3PWZ  [CONN-TH_3P-P2.00_BX-PH2.0-3PWZ]  11.56 6.86 0 top
U2  BX-PH2.0-3PWZ  [CONN-TH_3P-P2.00_BX-PH2.0-3PWZ]  20.45 6.86 0 top
U3  BX-PH2.0-3PWZ  [CONN-TH_3P-P2.00_BX-PH2.0-3PWZ]  38.48 6.86 0 top
U4  BX-PH2.0-3PWZ  [CONN-TH_3P-P2.00_BX-PH2.0-3PWZ]  29.46 6.86 0 top
USB1  10.0 QHHTZB6.3  [USB-A-TH_10.0QHHTZB6.3]  31.5 43.31 180 top
直流1  -  [SMA-TH_BWSMA-KE-Z001]  45.34 13.84 0 top

## Footprints (pads in the part's own frame, mm; a bottom-side part is the same pattern mirrored in y, then rotated)
C0805
  rect 1.41x1.35 smd: 1(-1,0) 2(1,0)
C_Ele_SMD_5x5.4mm
  rect 2.7x0.91 smd: 1(-2.4,0) 2(2.4,0)
CONN-TH_2P-P5.00_WJ500V-5.08-2P
  round 2 hole 1.3: 1(-2.54,0) 2(2.54,0)
CONN-TH_3P-P2.00_BX-PH2.0-3PWZ
  rect 1.5x1.5 hole 0.9: 1(-2,0)
  round 1.5 hole 0.9: 2(0,0) 3(2,0)
CONN-TH_3P-P5.00_WJ500V-5.08-3P
  round 2 hole 1.3: 1(-5.08,0) 2(0,0) 3(5.08,0)
DC-005_2.5
  oval 2x4.6 hole 1.2x3.7: 1(-3.227,-0.318) 2(2.973,-0.318)
  oval 4.6x2 hole 3.7x1.2: 3(-0.227,4.382)
HDR-TH_2P-P2.54-V-F
  rect 1.7x1.7 hole 1: 1(-1.27,0)
  round 1.7 hole 1: 2(1.27,0)
LED_0805
  rect 1x1.25 smd: 1(-1.15,0.005) 2(1.05,0.005)
M3-MOUNTHOLE-PLATED
  round 5.2 hole 3.005x3: 1(0,0)
R0805
  rect 1.133x1.377 smd: 1(-1,0) 2(1,0)
SMA-TH_BWSMA-KE-Z001
  round 2.2 hole 1.5: 1(-2.55,-2.55) 2(-2.55,2.55) 3(2.55,2.55) 4(2.55,-2.55)
  round 2 hole 1.35: 5(0,0)
SOD-123F_L2.7-W1.6-LS3.8-RD
  rect 1.1x1 smd: 1(-1.735,0) 2(1.735,0)
SW-TH_3P-P4.70_L11.1-W12.7
  rect 2.5x3 hole 1.8: 1(-4.7,0)
  round 3 hole 1.8: 2(0,0) 3(4.7,0)
USB-A-TH_10.0QHHTZB6.3
  rect 1.12x2.88 smd: 1(-3.5,4.395) 2(-1,4.395) 3(1,4.395) 4(3.5,4.395)
  oval 1.2x3.1 hole 0.7x2.5: 5(-6.45,-4.395) 6(6.45,-4.395)

## Nets
As in the schematic.

Pads without a net: M1 1; M2 1; M3 1; M4 1; SW1 1; USB1 2 3

## Via types
v1: diameter 0.61, hole 0.305, Top Layer to Bottom Layer, 51 vias

## Routing (per net, layer and track width the routed paths; a pad name or vN(x,y) marks a point on that pad's centre or on a via; arc(x,y) is an arc through that point)
+5V:
  vias: v1(23.88,14.22) v1(23.87,13.12) v1(24,21.46) v1(24,20.45) v1(24.02,19.34) v1(25.14,21.46) v1(25.09,20.45) v1(25.09,19.34) v1(25.27,14.22) v1(25.27,13.12) v1(36.19,39.62) v1(36.18,38.8) v1(36.18,37.83) v1(37.06,39.62) v1(37.06,38.8) v1(37.07,37.83)
-5V:
  vias: v1(20.96,32.13) v1(20.96,31.03) v1(22.1,32.13) v1(22.1,30.99)
GND:
  vias: v1(4.37,41.61) v1(9.45,46.69) v1(9.45,41.61) v1(9.45,31.44) v1(9.45,26.36) v1(9.45,0.97) v1(14.53,46.69) v1(14.53,41.61) v1(14.53,0.97) v1(19.61,16.2) v1(19.61,11.12) v1(19.61,0.97) v1(24.69,41.61) v1(24.69,36.53) v1(24.69,6.05) v1(24.69,0.97) v1(29.77,16.2) v1(29.77,11.12) v1(29.77,0.97) v1(34.85,26.36) v1(34.85,21.28) v1(34.85,16.2) v1(34.85,11.12) v1(34.85,0.97) v1(39.93,36.53) v1(39.93,31.44) v1(39.93,21.28) v1(39.93,16.2) v1(39.93,11.12) v1(39.93,0.97) v1(45.01,36.53)
VIN: length 7.6
  Top Layer w1: R5.1 7.05,10.43 10.79,10.43 11.3,10.94 SW1.3
$1N706: length 4.2
  Top Layer w0.5: LED3.2 4.35,8.73 4.83,8.25 R5.2

## Copper pours and planes (outline as drawn; the poured copper is in the pictures)
+5V on Top Layer: 38.35,24.64 38.35,22.35 34.12,22.35 34.12,19.56 31.63,19.56 31.63,22.09 31.5,22.22 25.77,22.22 25.77,9.53 37.59,9.53 37.59,5.72 37.08,5.21 35.43,5.21 35.05,5.59 35.05,7.75 34.54,8.25 29.08,8.25 28.57,7.75 28.57,5.46 28.07,4.95 26.54,4.95 26.16,5.33 26.16,7.49 25.65,8 19.81,8 19.56,7.75 19.56,5.72 17.2,5.72 17.2,7.31 16.38,8.13 10.92,8.13 10.79,8 10.79,5.72 10.29,5.21 8.76,5.21 8.38,5.59 8.38,9.56 23.37,9.56 23.37,24.89 31.5,24.89 31.88,24.51 38.23,24.51
+5V on Top Layer: 33.75,40.86 37.59,40.86 37.59,37.21 33.75,37.21
+5V on Bottom Layer: 23.37,21.97 26.29,21.97 26.29,37.21 33.53,37.21 33.53,41.02 36.7,41.02 36.83,41.15 36.89,41.08 37.51,41.08 37.51,36.58 37.47,36.53 37.47,34.29 30.61,34.29 30.48,34.16 30.48,18.42 23.37,18.42
+5V on Bottom Layer: 23.75,14.73 43.81,14.73 44.2,15.11 46.74,15.11 46.99,14.86 46.99,12.57 46.74,12.32 44.2,12.32 43.81,12.7 23.11,12.7 23.11,14.74 23.74,14.74
+12V on Top Layer: 17.02,50.42 24,50.42 24,39.5 19.3,34.8 19.3,17.53 17.91,16.13 8.64,16.13 8.25,16.51 8.25,20.19 9.02,20.95 13.97,20.95 13.97,34.92 9.91,34.92 9.02,35.81 9.02,38.61 9.78,39.37 16.13,39.37 17.02,40.26
-5V on Top Layer: 38.1,33.02 38.1,29.21 36.19,29.21 36.19,30.23 33.78,30.23 33.78,29.34 33.53,29.08 31.62,29.08 31.37,29.34 31.37,30.1 20.32,30.1 20.32,33.02
-5V on Bottom Layer: 19.81,33.4 22.73,33.4 22.73,10.16 41.15,10.16 41.66,9.65 41.66,5.5 41.47,5.31 39.77,5.31 39.5,5.59 39.5,8 39.24,8.25 33.02,8.25 32.64,7.87 32.64,5.59 32.38,5.33 30.86,5.33 30.48,5.72 30.48,8 30.1,8.38 24.13,8.38 23.62,7.87 23.62,5.84 23.37,5.59 21.72,5.59 21.46,5.84 21.46,8.13 21.21,8.38 14.86,8.38 14.86,6.1 14.48,5.72 12.7,5.72 12.32,6.1 12.32,9.4 13.08,10.16 19.81,10.16
GND on Top Layer: -3.05,57.4 65.53,57.4 65.53,-8.64 -3.05,-8.64
GND on Bottom Layer: -8.13,54.61 57.28,54.61 57.28,-4.19 -8.13,-4.19
VIN on Top Layer: 8.89,15.88 16.89,15.88 17.53,15.24 17.53,12.19 16.89,11.56 4.44,11.56 3.3,12.7 3.3,35.43 3.94,36.07 8.25,36.07 9.4,34.92 9.4,32.51 8,31.11 5.97,31.11 4.95,30.1 4.95,27.64 6.44,26.16 6.44,16.7 7.25,15.88 8.88,15.88
$1N2849 on Top Layer: 45.72,35.69 46.23,35.18 46.23,31.88 45.72,31.37 43.81,31.37 42.67,32.51 42.67,33.66 42.6,33.59 35.37,33.59 35.37,35.69
$1N2856 on Top Layer: 38.48,27.56 38.48,26.03 45.72,26.03 46.23,25.53 46.23,21.84 46.1,21.72 43.56,21.72 43.43,21.84 43.43,24.26 42.8,24.89 36.16,24.89 36.03,25.02 36.03,27.56

Small or netless copper shapes (teardrops, artwork), in the pictures only: 4 on Top Layer

## Text on the board
Top Silkscreen Layer: 电 | 源

# Board PCB1
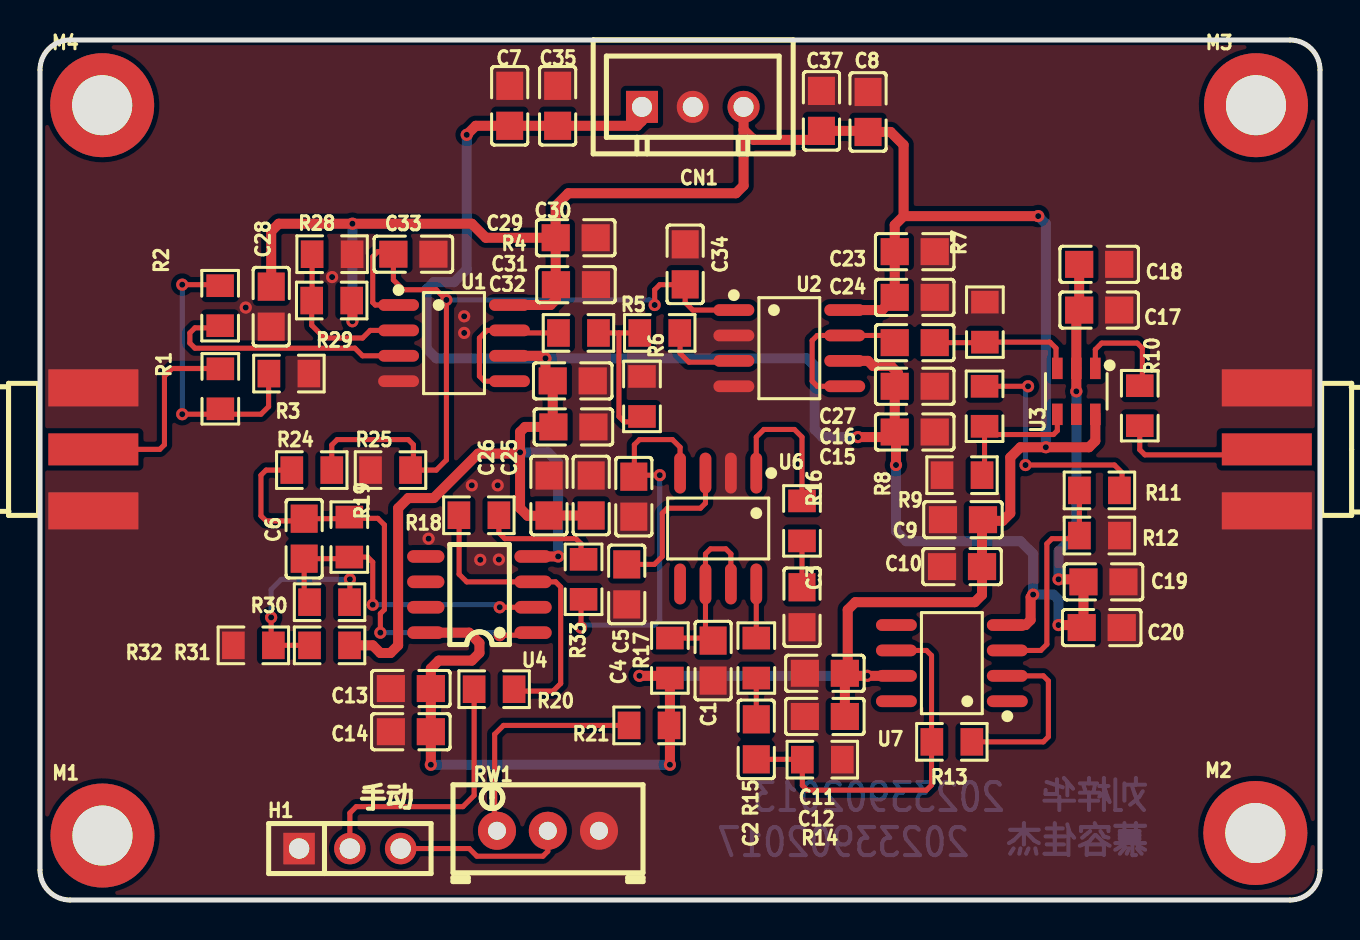
[diagram p5: board, top side]
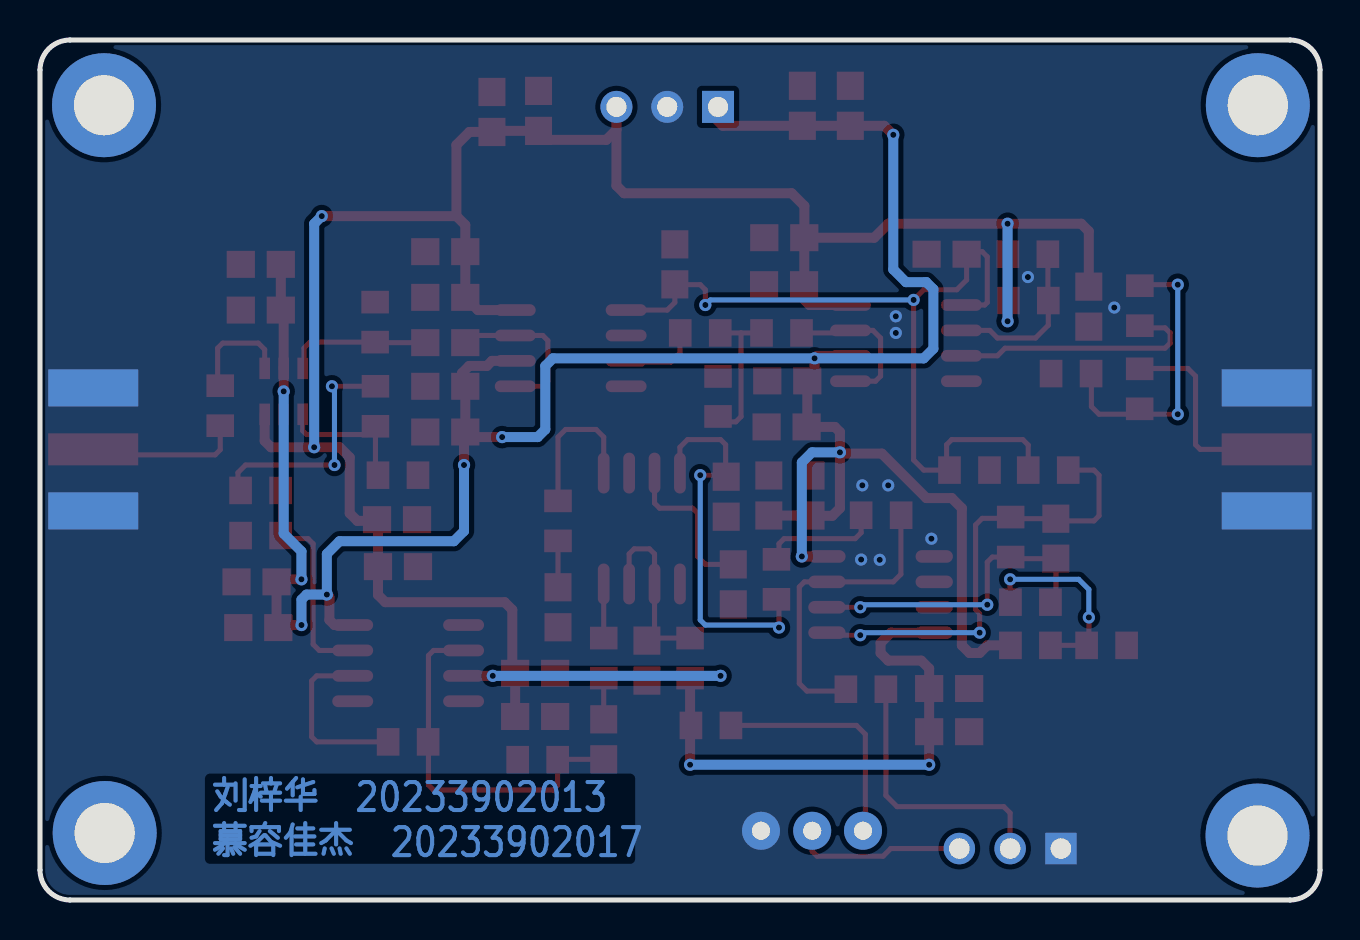
[diagram p6: board, bottom side, seen from below]

Outline 64 x 43 mm; copper layers: Top Layer, Bottom Layer. Coordinates in mm from the lower left corner of the outline.
Outline path: 0,41.5 0,1.5 arc(0.44,0.44) 1.5,0 62.5,0 arc(63.56,0.44) 64,1.5 64,41.5 arc(63.56,42.56) 62.5,43 1.5,43 arc(0.44,42.56) 0,41.5
Stack: Top Layer 0.035mm / Dielectric1 1.51mm FR4 er 4.5 / Bottom Layer 0.035mm

## Design rules (mm)
template: 自定义配置
spacing copperThickness1oz (default): track to track 0.102, other pairs 0.152 to 0.3
spacing copperThickness2oz: track to track 0.203, other pairs 0.152 to 0.3
track width copperThickness1oz (default): min 0.127, default 0.254, max 2.54
track width copperThickness2oz: min 0.203, default 0.254, max 2.54
differential pair differentialPair (default): width min 0.127, default 0.254, max 2.54; gap min 0.152, default 0.152
via viaSize (default): diameter min 0.5, default 0.61, max 10; hole min 0.3, default 0.305, max 6.3

## Placement (name value [footprint] x y rotation side)
C1  106  [C0805]  33.66 11.97 270 top
C2  106  [C0805]  35.81 8.03 270 top
C3  106  [C0805]  38.1 14.64 270 top
C4  105  [C0805]  29.34 15.78 270 top
C5  103  [C0805]  29.69 20.17 90 top
C6  104  [C0805]  13.21 18.07 90 top
C7  104  [C0805]  23.48 39.71 270 top
C8  104  [C0805]  41.4 39.4 270 top
C9  106  [C0805]  46.15 19.02 0 top
C10  104  [C0805]  46.1 16.67 0 top
C11  106  [C0805]  39.24 11.34 0 top
C12  104  [C0805]  39.24 9.18 0 top
C13  106  [C0805]  18.54 10.57 0 top
C14  104  [C0805]  18.54 8.41 0 top
C15  106  [C0805]  43.74 23.4 180 top
C16  104  [C0805]  43.74 25.69 180 top
C17  106  [C0805]  52.96 29.5 180 top
C18  104  [C0805]  52.96 31.78 180 top
C19  106  [C0805]  53.17 15.91 180 top
C20  104  [C0805]  53.09 13.62 180 top
C23  106  [C0805]  43.74 32.42 180 top
C24  104  [C0805]  43.74 30.13 180 top
C25  106  [C0805]  27.56 20.23 270 top
C26  104  [C0805]  25.45 20.22 270 top
C27  106  [C0805]  43.74 27.87 0 top
C28  104  [C0805]  11.56 29.67 90 top
C29  106  [C0805]  26.8 30.77 180 top
C30  104  [C0805]  26.79 33.11 180 top
C31  106  [C0805]  26.64 25.96 180 top
C32  104  [C0805]  26.67 23.65 180 top
C33  102  [C0805]  18.67 32.29 0 top
C34  102  [C0805]  32.26 31.78 90 top
C35  10uf  [C0805]  25.88 39.71 270 top
C37  10uf  [C0805]  39.07 39.46 270 top
CN1  ZX-XH2.54-3PZZ  [CONN-TH_3P-P2.54_2501S-3P]  32.64 39.66 0 top
H1  -  [HDR-TH_3P-P2.54-V-F]  15.49 2.57 0 top
M1  MountHole  [M3-MOUNTHOLE-PLATED]  3.12 3.22 0 top
M2  MountHole  [M3-MOUNTHOLE-PLATED]  60.77 3.35 0 top
M3  MountHole  [M3-MOUNTHOLE-PLATED]  60.8 39.74 0 top
M4  MountHole  [M3-MOUNTHOLE-PLATED]  3.11 39.74 0 top
R1  10  [R0805]  9.02 25.56 270 top
R2  68  [R0805]  9.01 29.72 270 top
R3  50  [R0805]  12.45 26.32 0 top
R4  430  [R0805]  26.92 28.35 180 top
R5  51  [R0805]  30.99 28.35 180 top
R6  430  [R0805]  30.1 25.18 270 top
R7  100  [R0805]  47.24 28.89 270 top
R8  390  [R0805]  47.23 24.69 90 top
R9  160  [R0805]  46.1 21.24 0 top
R10  50  [R0805]  54.99 24.72 270 top
R11  10  [R0805]  52.97 20.48 180 top
R12  50  [R0805]  52.97 18.22 0 top
R13  22  [R0805]  45.59 7.91 0 top
R14  50  [R0805]  39.12 7.02 0 top
R15  0  [R0805]  35.81 12.1 90 top
R16  0  [R0805]  38.1 18.96 90 top
R17  4.7  [R0805]  31.5 12.1 270 top
R18  10k  [R0805]  21.94 19.24 180 top
R19  2M  [R0805]  15.47 18.15 270 top
R20  10k  [R0805]  22.71 10.54 0 top
R21  10k  [R0805]  30.45 8.73 0 top
R24  10k  [R0805]  13.59 21.5 0 top
R25  6.8k  [R0805]  17.53 21.5 0 top
R28  10K  [R0805]  14.6 32.29 180 top
R29  3.9k  [R0805]  14.59 29.97 0 top
R30  2M  [R0805]  14.48 14.89 0 top
R31  10k  [R0805]  14.48 12.73 0 top
R32  1k  [R0805]  10.67 12.73 0 top
R33  1k  [R0805]  27.18 16.03 90 top
RF3  A-SMA-KE-13.5A  [SMA-SMD_A-SMA-KE-13.5A]  2.67 22.53 0 top
RF4  A-SMA-KE-13.5A  [SMA-SMD_A-SMA-KE-13.5A]  61.34 22.53 180 top
RW1  1kΩ  [RES-ADJ-TH_3P-L9.5-W4.9-P2.50-L_3296W]  25.4 3.46 0 top
U1  AD603ARZ-REEL  [SOIC-8_L4.9-W3.9-P1.27-LS6.0-BL]  20.7 27.85 270 top
U2  AD603ARZ-REEL  [SOIC-8_L4.9-W3.9-P1.27-LS6.0-BL]  37.47 27.59 270 top
U3  OPA690IDBVR  [SOT-23-6_L2.9-W1.6-P0.95-LS2.8-BL]  51.82 25.43 180 top
U4  NE5532M/TR  [SOP-8_L4.9-W3.9-P1.27-LS6.0-BL]  21.97 15.27 90 top
U6  AD8307ARZ  [SOIC-8_L4.9-W3.9-P1.27-LS6.0-BL]  33.91 18.57 180 top
U7  OPA690ID  [SOIC-8_L4.9-W3.9-P1.27-LS6.0-BL]  45.59 11.84 90 top

## Footprints (pads in the part's own frame, mm; a bottom-side part is the same pattern mirrored in y, then rotated)
C0805
  rect 1.41x1.35 smd: 1(-1,0) 2(1,0)
CONN-TH_3P-P2.54_2501S-3P
  rect 1.6x1.6 hole 1: 1(-2.54,0)
  round 1.6 hole 1: 2(0,0) 3(2.54,0)
HDR-TH_3P-P2.54-V-F
  rect 1.575x1.575 hole 1.02: 1(-2.54,0)
  round 1.575 hole 1.02: 2(0,0) 3(2.54,0)
M3-MOUNTHOLE-PLATED
  round 5.2 hole 3.005x3: 1(0,0)
R0805
  rect 1.133x1.377 smd: 1(-1,0) 2(1,0)
RES-ADJ-TH_3P-L9.5-W4.9-P2.50-L_3296W
  round 1.9 hole 0.9: 1(-2.55,0) 2(-0.01,0) 3(2.55,0)
SMA-SMD_A-SMA-KE-13.5A
  rect 4.5x1.6 smd: 1(0,-0.001)
  rect 4.5x1.85 smd: 2(0,-3.075) 3(0,3.075)
  rect 4.5x1.85 smd far side: 4(0,-3.075) 5(0,3.075)
SOIC-8_L4.9-W3.9-P1.27-LS6.0-BL
  oval 0.588x2.045 smd: 1(-1.905,-2.772) 2(-0.635,-2.772) 3(0.635,-2.772) 4(1.905,-2.772) 5(1.905,2.772) 6(0.635,2.772) 7(-0.635,2.772) 8(-1.905,2.772)
SOP-8_L4.9-W3.9-P1.27-LS6.0-BL
  oval 0.63x1.865 smd: 1(-1.905,-2.683) 2(-0.635,-2.683) 3(0.635,-2.683) 4(1.905,-2.683) 5(1.905,2.683) 6(0.635,2.683) 7(-0.635,2.683) 8(-1.905,2.683)
SOT-23-6_L2.9-W1.6-P0.95-LS2.8-BL
  rect 0.532x1.072 smd: 1(-0.95,-1.149) 2(0,-1.149) 3(0.95,-1.149) 4(0.95,1.149) 5(0,1.149) 6(-0.95,1.149)

## Nets
As in the schematic.

Pads without a net: M1 1; M2 1; M3 1; M4 1; U3 5; U4 5 6 7; U6 5; U7 1 5 8

## Via types
v1: diameter 0.61, hole 0.305, Top Layer to Bottom Layer, 41 vias

## Routing (per net, layer and track width the routed paths; a pad name or vN(x,y) marks a point on that pad's centre or on a via; arc(x,y) is an arc through that point)
GND:
  vias: v1(10.29,29.62) v1(14.6,31.15) v1(19.43,18.07) v1(21.21,29.19) v1(21.21,28.35) v1(21.59,20.73) v1(22.01,17.01) v1(22.88,20.73) v1(22.94,17.02)
VCC: length 151.3
  Top Layer w0.5: 35.18,38.51 35.69,38.01 38.62,38.01 C37.2 41.35,38.46 C8.2 42.53,38.4 43.18,37.75 43.18,34.2 ; 35.18,38.51 35.18,35.72 34.8,35.34 26.42,35.34 25.78,34.7 25.78,33.12 C30.2 ; 35.18,38.51 CN1.3 ; v1(29.97,11.21) 31.38,11.21 R17.2 31.5,8.77 R21.2 31.5,8.69 v1(31.5,6.76) ; 43.18,34.2 42.74,33.75 C23.2 C24.2 42.1,29.5 U2.8 ; 43.18,34.2 v1(49.91,34.2) ; U4.8 21.46,13.37 21.97,12.85 21.97,12.35 21.59,11.97 19.94,11.97 19.54,11.57 C13.2 C14.2 v1(19.54,6.76) ; C30.2 25.79,30.78 C29.2 25.8,30.02 25.53,29.75 U1.8 ; C30.2 22.29,33.11 21.59,33.81 v1(15.62,33.81) 11.94,33.81 11.56,33.44 C28.2 ; U7.7 v1(41.36,11.21) 40.37,11.21 C11.2 ; R29.2 15.62,29.94 v1(15.62,28.94) ; C11.2 40.39,11.48 40.39,14.51 40.77,14.89 46.74,14.89 47.1,15.26 C10.2 47.1,18.97 C9.2 47.21,18.96 48.13,18.96 48.51,19.34 48.51,22.13 49.02,22.64 v1(50.29,22.64) 52.45,22.64 52.77,22.95 U3.6 ; C11.2 C12.2
  Bottom Layer w0.5: v1(50.29,22.64) 50.29,33.81 v1(49.91,34.2) ; v1(41.36,11.21) v1(29.97,11.21) ; v1(19.54,6.76) v1(31.5,6.76) ; v1(15.62,28.94) v1(15.62,33.81)
VEE: length 135.3
  Top Layer w0.5: C15.2 C16.2 42.74,26.19 42.9,26.35 42.54,26.7 41.66,26.7 41.4,26.96 U2.6 ; C15.2 42.8,23.34 v1(42.8,21.75) ; C15.2 42.48,23.15 v1(40.89,23.15) ; v1(49.66,15.27) 49.53,15.15 49.53,14 49.28,13.75 U7.4 ; v1(21.34,38.26) 21.79,38.71 C7.2 C35.2 29.86,38.71 30.1,38.95 CN1.1 ; C18.2 C17.2 51.82,29.35 U3.2 v1(51.82,25.43) ; v1(24,22.38) 24,19.59 24.38,19.21 25.43,19.21 C26.2 27.56,19.22 ; v1(24,22.38) 24,23.4 24.26,23.65 C32.2 25.64,23.69 C31.2 25.27,26.32 v1(25.27,27.08) 25.15,27.21 U1.6 ; v1(24,22.38) 23.94,22.32 21.91,22.32 19.69,20.1 18.41,20.1 17.91,19.59 17.91,12.73 17.53,12.35 17.02,12.35 16.64,12.73 R31.2 ; v1(50.93,13.75) 51.96,13.75 C20.2 52.17,13.71 C19.2 52.05,16.03 v1(50.93,16.03) ; U4.4 v1(25.91,17.18)
  Bottom Layer w0.5: v1(50.93,13.75) 50.93,15.02 50.67,15.27 v1(49.66,15.27) 49.66,17.3 49.02,17.94 43.31,17.94 42.8,18.45 v1(42.8,21.75) ; v1(40.89,23.15) 39.12,23.15 38.74,23.53 38.74,26.7 38.35,27.08 v1(25.27,27.08) 19.81,27.08 19.33,27.56 19.33,30.54 19.69,30.89 20.7,30.89 21.34,31.53 v1(21.34,38.26) ; v1(51.82,25.43) 51.82,18.32 50.93,17.43 v1(50.93,16.03) ; v1(25.91,17.18) 25.91,21.88 25.4,22.38 v1(24,22.38)
$1N3249: length 8.1
  Top Layer w0.254: C27.1 42.38,28.23 U2.7 38.86,28.23 38.61,27.97 38.61,25.94 38.86,25.69 U2.5
$1N3303: length 7.7
  Top Layer w0.254: R4.2 23.6,28.35 U1.7 22.35,28.48 21.97,28.1 21.97,26.19 22.22,25.94 U1.5
$1N3353: length 8.3
  Top Layer w0.254: R28.2 13.6,29.99 R29.1 13.59,28.74 14.22,28.1 16.13,28.1 16.51,28.48 U1.2
$1N3727: length 5.5
  Top Layer w0.254: R10.1 55.12,25.85 55.12,27.59 54.86,27.85 53.09,27.85 52.77,27.53 U3.1
$1N9984: length 10
  Top Layer w0.254: R1.1 9,26.58 6.6,26.58 6.22,26.19 6.22,22.77 5.99,22.53 RF3.1
$1N9995: length 14.7
  Top Layer w0.254: R2.1 8.95,30.77 v1(7.11,30.77) ; v1(7.11,24.29) 8.75,24.29 R1.2 9.29,24.29 11.05,24.29 11.43,24.67 11.43,26.31 R3.1
  Bottom Layer w0.254: v1(7.11,24.29) v1(7.11,30.77)
$1N10003: length 12.9
  Top Layer w0.254: U1.3 16.13,27.21 15.75,27.59 7.75,27.59 7.49,27.85 7.49,28.35 7.75,28.61 8.9,28.61 R2.2
$1N10949: length 7.6
  Top Layer w0.254: 28.95,28.35 R5.2 ; 28.95,28.35 R4.1 ; 28.95,28.35 28.95,24.17 29.21,23.91 29.83,23.91 R6.2
$1N10954: length 3.9
  Top Layer w0.254: R5.1 32,28.34 32,27.34 32.45,26.89 34.63,26.89 U2.3
$1N11121: length 7.2
  Top Layer w0.254: C27.2 47.22,27.87 R7.2 50.5,27.89 50.8,27.59 50.8,26.65 U3.3
$1N11380: length 7.2
  Top Layer w0.254: U3.4 50.87,23.47 50.67,23.27 47.64,23.27 R8.1 47.23,21.37 R9.2
$1N11448: length 42.5
  Top Layer w0.254: U2.1 32.64,29.5 32.26,29.88 C34.1 32.24,30.77 30.99,30.77 30.73,30.51 v1(30.73,29.75) ; U1.1 16.76,29.75 16.64,29.88 16.64,32.16 16.89,32.42 17.54,32.42 C33.1 17.67,31 18.16,30.51 19.81,30.51 v1(20.32,30) 20.32,22 19.81,21.5 R25.2 18.67,21.64 18.67,22.77 18.41,23.02 14.86,23.02 14.59,22.75 R24.2
  Bottom Layer w0.254: v1(30.73,29.75) 30.48,30 v1(20.32,30)
$1N11598: length 23.4
  Top Layer w0.254: R24.1 11.3,21.5 11.05,21.24 11.05,19.21 11.3,18.96 13.1,18.96 C6.2 15.39,19.07 R19.1 15.53,19.08 16.89,19.08 17.22,18.75 17.22,14.52 17.02,14.32 v1(17.02,13.37) ; v1(22.99,13.24) 24.53,13.24 U4.1
  Bottom Layer w0.254: v1(22.99,13.24) 22.86,13.37 v1(17.02,13.37)
$1N11604: length 16.1
  Top Layer w0.254: v1(22.99,14.64) U4.2 ; v1(16.64,14.76) 16.64,16.89 16.38,17.15 R19.2 15.39,17.07 C6.1 13.21,15.16 R30.1
  Bottom Layer w0.254: v1(22.99,14.64) 22.86,14.76 v1(16.64,14.76)
$1N11741: length 9.9
  Top Layer w0.254: R30.2 15.49,14.91 v1(15.49,16.03) ; v1(11.56,14.13) 11.56,12.84 R32.2 R31.1
  Bottom Layer w0.254: v1(11.56,14.13) 11.56,15.53 12.06,16.03 v1(15.49,16.03)
$1N11936: length 15.6
  Top Layer w0.254: R18.2 20.96,19.23 20.96,16.29 21.34,15.91 U4.3 25.78,15.91 26.03,15.65 26.03,10.83 25.65,10.45 23.8,10.45 R20.2
$1N12020: length 13.7
  Top Layer w0.254: H1.2 15.49,4.35 15.81,4.67 21.15,4.67 21.71,5.23 R20.1
$1N12185: length 11.8
  Top Layer w0.254: RW1.1 22.73,3.58 22.73,8.29 23.18,8.73 R21.1
$1N12671: length 6
  Top Layer w0.254: 27.05,17.03 27.05,17.81 26.8,18.07 23.24,18.07 22.94,18.36 R18.1
$1N12821: length 8
  Top Layer w0.254: C4.1 30.72,16.78 31.12,17.18 31.12,19.34 31.37,19.59 33.02,19.59 33.27,19.84 U6.3
$1N12864: length 19.5
  Top Layer w0.254: 29.72,21.19 29.76,21.24 v1(30.99,21.24) ; 29.72,21.19 C5.2 ; 29.72,21.19 29.72,22.77 29.97,23.02 31.62,23.02 32,22.64 U6.4 ; 27.05,15.03 v1(27.05,13.62)
  Bottom Layer w0.254: v1(27.05,13.62) 27.18,13.75 30.73,13.75 30.99,14 v1(30.99,21.24)
$1N12907: length 7.6
  Top Layer w0.254: R16.2 38.1,23.15 37.72,23.53 36.19,23.53 35.81,23.15 U6.1
$1N12916: length 9.5
  Top Layer w0.254: 33.53,13.1 33.27,13.35 U6.6 33.27,17.3 33.53,17.56 34.29,17.56 34.54,17.3 U6.7 ; 33.53,13.1 C1.1 ; 33.53,13.1 R17.1
$1N12924: length 2.7
  Top Layer w0.254: R15.2 U6.8
$1N13008: length 2.1
  Top Layer w0.254: C2.1 R15.1
$1N13036: length 2.3
  Top Layer w0.254: R16.1 C3.1
$1N13203: length 18.6
  Top Layer w0.254: U7.6 44.32,12.48 44.58,12.22 44.58,7.92 R13.1 44.58,7.89 44.58,5.75 44.32,5.49 38.35,5.49 38.12,5.73 R14.1 38.1,7.03 C2.2
$1N13290: length 8.9
  Top Layer w0.254: R13.2 50.16,7.91 50.42,8.16 50.42,10.95 50.16,11.21 U7.2
$1N13397: length 11.2
  Top Layer w0.254: U7.3 50.04,12.48 50.34,12.78 50.34,17.81 50.6,18.07 51.81,18.07 R12.1 R11.2
$1N13402: length 12.1
  Top Layer w0.254: R8.2 v1(49.4,25.69) ; R11.1 54.1,20.61 54.1,21.37 53.72,21.75 v1(49.28,21.75)
  Bottom Layer w0.254: v1(49.4,25.69) 49.28,25.56 v1(49.28,21.75)
$1N13429: length 7.8
  Top Layer w0.254: R10.2 54.99,22.51 55.25,22.26 61.07,22.26 RF4.1
$1N14118: length 8.6
  Top Layer w0.254: RW1.2 25.39,2.44 25.15,2.19 21.84,2.19 21.46,2.57 H1.3

## Copper pours and planes (outline as drawn; the poured copper is in the pictures)
GND on Top Layer: -5.21,51.21 71.12,51.21 71.12,-5.81 -5.21,-5.81
GND on Bottom Layer: -5.46,51.21 70.87,51.21 70.87,-6.19 -5.46,-6.19

## Text on the board
Bottom Layer: 刘梓华  20233902013 / 慕容佳杰  20233902017
Top Silkscreen Layer: 手动

# Board PCB4
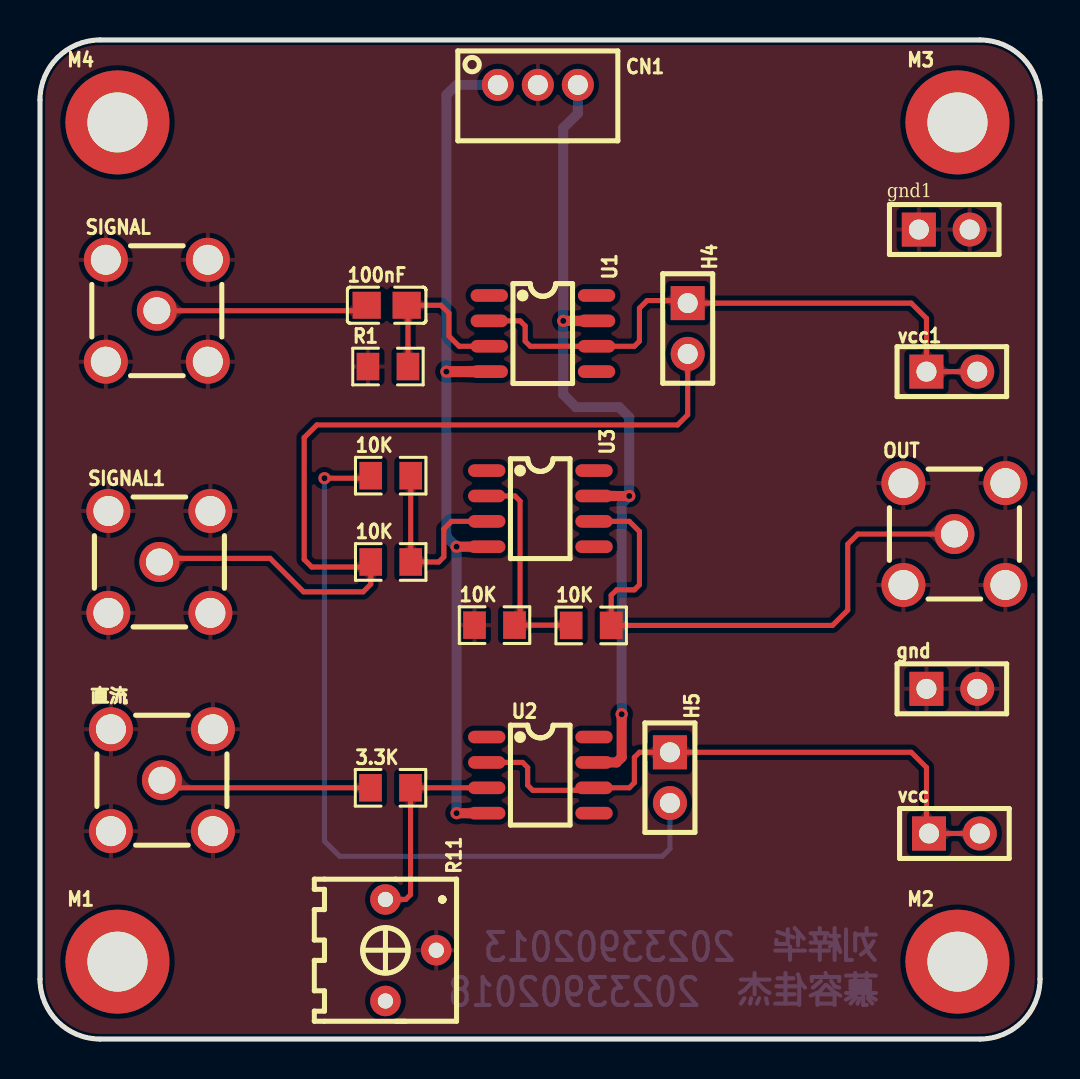
[diagram p7: board, top side]
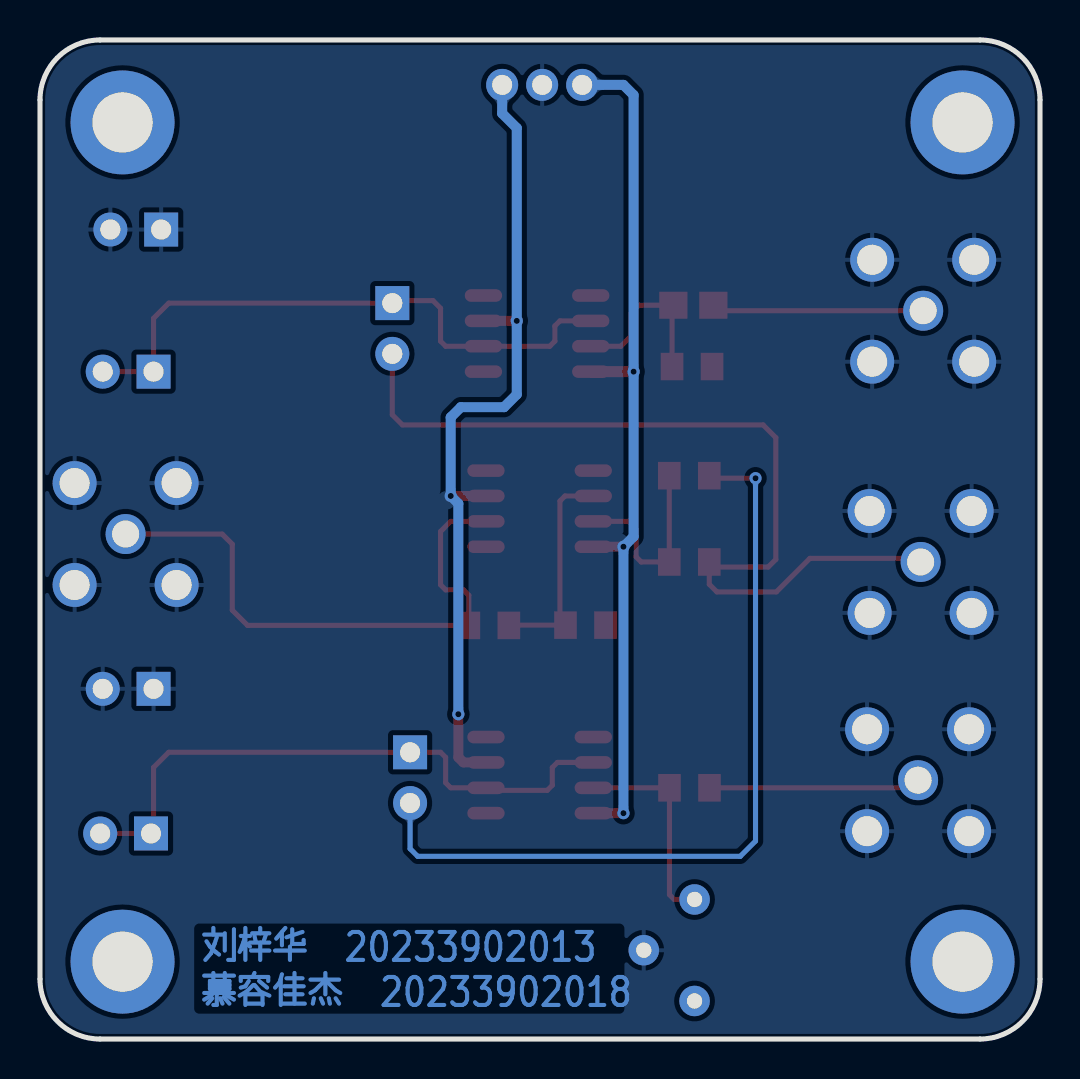
[diagram p8: board, bottom side, seen from below]

Outline 50 x 50 mm; copper layers: Top Layer, Bottom Layer. Coordinates in mm from the lower left corner of the outline.
Outline path: 0,47 0,3 arc(0.88,0.88) 3,0 47,0 arc(49.12,0.88) 50,3 50,47 arc(49.12,49.12) 47,50 3,50 arc(0.88,49.12) 0,47
Stack: Top Layer 0.035mm / Dielectric1 1.51mm FR4 er 4.5 / Bottom Layer 0.035mm

## Design rules (mm)
template: JLCPCB Capability(Two Layers Board)
spacing copperThickness1oz (default): track to track 0.102, other pairs 0.152 to 0.3
spacing copperThickness2oz: track to track 0.203, other pairs 0.152 to 0.3
track width copperThickness1oz (default): min 0.127, default 0.254, max 2.54
track width copperThickness2oz: min 0.203, default 0.254, max 2.54
differential pair differentialPair (default): width min 0.127, default 0.254, max 2.54; gap min 0.152, default 0.152
via viaSize (default): diameter min 0.5, default 0.61, max 10; hole min 0.3, default 0.305, max 6.3

## Placement (name value [footprint] x y rotation side)
3.3K  3.3K  [R0805]  17.53 12.57 0 top
10K  10K  [R0805]  17.54 28.19 0 top
10K#2  10K  [R0805]  17.54 23.88 0 top
10K#3  10K  [R0805]  22.73 20.71 0 top
10K#4  10K  [R0805]  27.56 20.7 0 top
100nF  100nF  [C0805]  17.33 36.72 0 top
CN1  B3B-PH-K-S(LF)(SN)  [CONN-TH_B3B-PH-K-S]  24.89 47.75 180 top
gnd  -  [HDR-TH_2P-P2.54-V-F]  45.59 17.53 0 top
gnd1  -  [HDR-TH_2P-P2.54-V-F]  45.21 40.51 0 top
H4  -  [HDR-TH_2P-P2.54-V-F]  32.39 35.56 270 top
H5  -  [HDR-TH_2P-P2.54-V-F]  31.5 13.08 270 top
M1  MountHole  [M3-MOUNTHOLE-PLATED]  3.87 3.87 0 top
M2  MountHole  [M3-MOUNTHOLE-PLATED]  45.87 3.87 0 top
M3  MountHole  [M3-MOUNTHOLE-PLATED]  45.87 45.87 0 top
M4  MountHole  [M3-MOUNTHOLE-PLATED]  3.87 45.87 0 top
OUT  -  [SMA-TH_BWSMA-KE-Z001]  45.72 25.27 0 top
R1  1M  [R0805]  17.4 33.65 0 top
R11  2kΩ  [RES-ADJ-TH_3362P]  18.54 4.44 270 top
SIGNAL  -  [SMA-TH_BWSMA-KE-Z001]  5.84 36.45 0 top
SIGNAL1  -  [SMA-TH_BWSMA-KE-Z001]  5.97 23.88 0 top
U1  OPA277UA(UMW)  [SOP-8_L4.9-W3.9-P1.27-LS6.0-BL]  25.15 35.31 270 top
U2  OPA277UA(UMW)  [SOP-8_L4.9-W3.9-P1.27-LS6.0-BL]  25.02 13.21 270 top
U3  OPA277UA(UMW)  [SOP-8_L4.9-W3.9-P1.27-LS6.0-BL]  25.02 26.54 270 top
vcc  -  [HDR-TH_2P-P2.54-V-F]  45.72 10.29 0 top
vcc1  -  [HDR-TH_2P-P2.54-V-F]  45.59 33.4 0 top
直流  -  [SMA-TH_BWSMA-KE-Z001]  6.1 12.95 0 top

## Footprints (pads in the part's own frame, mm; a bottom-side part is the same pattern mirrored in y, then rotated)
C0805
  rect 1.41x1.35 smd: 1(-1,0) 2(1,0)
CONN-TH_B3B-PH-K-S
  round 1.6 hole 1: 1(2,0) 2(0,0) 3(-2,0)
HDR-TH_2P-P2.54-V-F
  rect 1.7x1.7 hole 1: 1(-1.27,0)
  round 1.7 hole 1: 2(1.27,0)
M3-MOUNTHOLE-PLATED
  round 5.2 hole 3.005x3: 1(0,0)
R0805
  rect 1.133x1.377 smd: 1(-1,0) 2(1,0)
RES-ADJ-TH_3362P
  round 1.524 hole 0.762: 1(-2.54,-1.27) 2(0,1.27) 3(2.54,-1.27)
SMA-TH_BWSMA-KE-Z001
  round 2.2 hole 1.5: 1(-2.55,-2.55) 2(-2.55,2.55) 3(2.55,2.55) 4(2.55,-2.55)
  round 2 hole 1.35: 5(0,0)
SOP-8_L4.9-W3.9-P1.27-LS6.0-BL
  oval 0.63x1.865 smd: 1(-1.905,-2.683) 2(-0.635,-2.683) 3(0.635,-2.683) 4(1.905,-2.683) 5(1.905,2.683) 6(0.635,2.683) 7(-0.635,2.683) 8(-1.905,2.683)

## Nets
GND: 10K#3.1 CN1.2 gnd.1 gnd.2 gnd1.1 gnd1.2 OUT.1 OUT.2 OUT.3 OUT.4 R1.1 R11.2 SIGNAL.1 SIGNAL.2 SIGNAL.3 SIGNAL.4 SIGNAL1.1 SIGNAL1.2 SIGNAL1.3 SIGNAL1.4 直流.1 直流.2 直流.3 直流.4
VCC: CN1.3 U1.7 U2.7 U3.7
VEE: CN1.1 U1.4 U2.4 U3.4
OUT1: 10K#2.1 H4.2 SIGNAL1.5
OUT2: 10K.1 H5.2
$1N724: 100nF.2 R1.2 U1.3
$1N819: 100nF.1 SIGNAL.5
$1N1086: H4.1 U1.2 U1.6 vcc1.1 vcc1.2
$1N1560: 3.3K.2 R11.1 U2.3
$1N1566: 3.3K.1 直流.5
$1N1600: H5.1 U2.2 U2.6 vcc.1 vcc.2
$1N1995: 10K.2 10K#2.2 U3.3
$1N2035: 10K#4.2 OUT.5 U3.6
$1N2362: 10K#3.2 10K#4.1 U3.2

Pads without a net: M1 1; M2 1; M3 1; M4 1; R11 3; U1 1 5 8; U2 1 5 8; U3 1 5 8

## Via types
v1: diameter 0.61, hole 0.305, Top Layer to Bottom Layer, 7 vias

## Routing (per net, layer and track width the routed paths; a pad name or vN(x,y) marks a point on that pad's centre or on a via; arc(x,y) is an arc through that point)
VCC: length 41.7
  Top Layer w0.5: U3.7 v1(29.46,27.18) ; U2.7 28.83,13.84 29.08,14.1 v1(29.08,16.26) ; U1.7 v1(26.16,35.94)
  Bottom Layer w0.5: CN1.3 26.89,46.32 26.16,45.59 v1(26.16,35.94) 26.16,32.26 26.8,31.62 28.96,31.62 29.46,31.11 v1(29.46,27.18) 29.08,26.8 v1(29.08,16.26)
VEE: length 44.1
  Top Layer w0.5: v1(20.83,24.64) U3.4 ; U2.4 v1(20.83,11.3)
  Top Layer w0.55: v1(20.32,33.4) U1.4
  Bottom Layer w0.5: CN1.1 20.83,47.75 20.32,47.24 v1(20.32,33.4) 20.32,25.15 v1(20.83,24.64) v1(20.83,11.3)
OUT1: length 45
  Top Layer w0.254: H4.2 32.39,31.24 31.88,30.73 13.84,30.73 13.21,30.1 13.21,24 13.59,23.62 16.28,23.62 10K#2.1 16.54,22.76 16.15,22.38 13.18,22.38 11.5,24.06 6.15,24.06 SIGNAL1.5
OUT2: length 40.6
  Top Layer w0.254: 10K.1 16.41,28.07 v1(14.22,28.07)
  Bottom Layer w0.254: H5.2 31.5,9.52 31.11,9.14 14.99,9.14 14.22,9.91 v1(14.22,28.07)
$1N724: length 8.7
  Top Layer w0.254: U1.3 20.95,34.67 20.45,35.18 20.45,36.32 20.05,36.72 100nF.2 18.4,36.66 R1.2
$1N819: length 10.6
  Top Layer w0.254: 100nF.1 16.06,36.45 SIGNAL.5
$1N1086: length 30.3
  Top Layer w0.254: U1.2 24,35.94 24.26,35.69 24.26,34.92 24.51,34.67 U1.6 29.72,34.67 29.97,34.92 29.97,36.58 30.35,36.96 32.26,36.96 H4.1 43.56,36.83 44.32,36.07 vcc1.1 vcc1.2
$1N1560: length 10.5
  Top Layer w0.254: U2.3 3.3K.2 18.53,7.22 18.29,6.98 R11.1
$1N1566: length 10.6
  Top Layer w0.254: 3.3K.1 6.48,12.57 直流.5
$1N1600: length 30.8
  Top Layer w0.254: U2.2 24.13,13.84 24.38,13.59 24.38,12.7 24.64,12.45 27.57,12.45 U2.6 29.46,12.57 29.72,12.83 29.72,14.1 29.97,14.35 H5.1 43.56,14.35 44.32,13.59 44.32,10.41 vcc.1 46.99,10.29
$1N1995: length 9.8
  Top Layer w0.254: 10K.2 10K#2.2 19.94,23.88 20.19,24.13 20.19,25.53 20.57,25.91 U3.3
$1N2035: length 29.3
  Top Layer w0.254: U3.6 29.46,25.91 29.97,25.4 29.97,22.73 29.72,22.48 28.83,22.48 28.56,22.21 10K#4.2 39.62,20.7 40.39,21.46 40.39,24.76 40.89,25.27 45.72,25.27
$1N2362: length 10.9
  Top Layer w0.254: 10K#4.1 26.55,20.71 10K#3.2 24,20.99 24,26.92 23.75,27.18 U3.2

## Copper pours and planes (outline as drawn; the poured copper is in the pictures)
GND on Top Layer: -3.81,52.45 56.77,52.45 56.77,-3.68 -3.81,-3.68
GND on Bottom Layer: -3.3,52.2 56.64,52.2 56.64,-3.3 -3.3,-3.3

Small or netless copper shapes (teardrops, artwork), in the pictures only: 58 on Top Layer, 14 on Bottom Layer

## Text on the board
Bottom Layer: 刘梓华  20233902013 / 慕容佳杰  20233902018
